# EAGLE board M868H (EAGLE 6.6.0), part 1 of 2
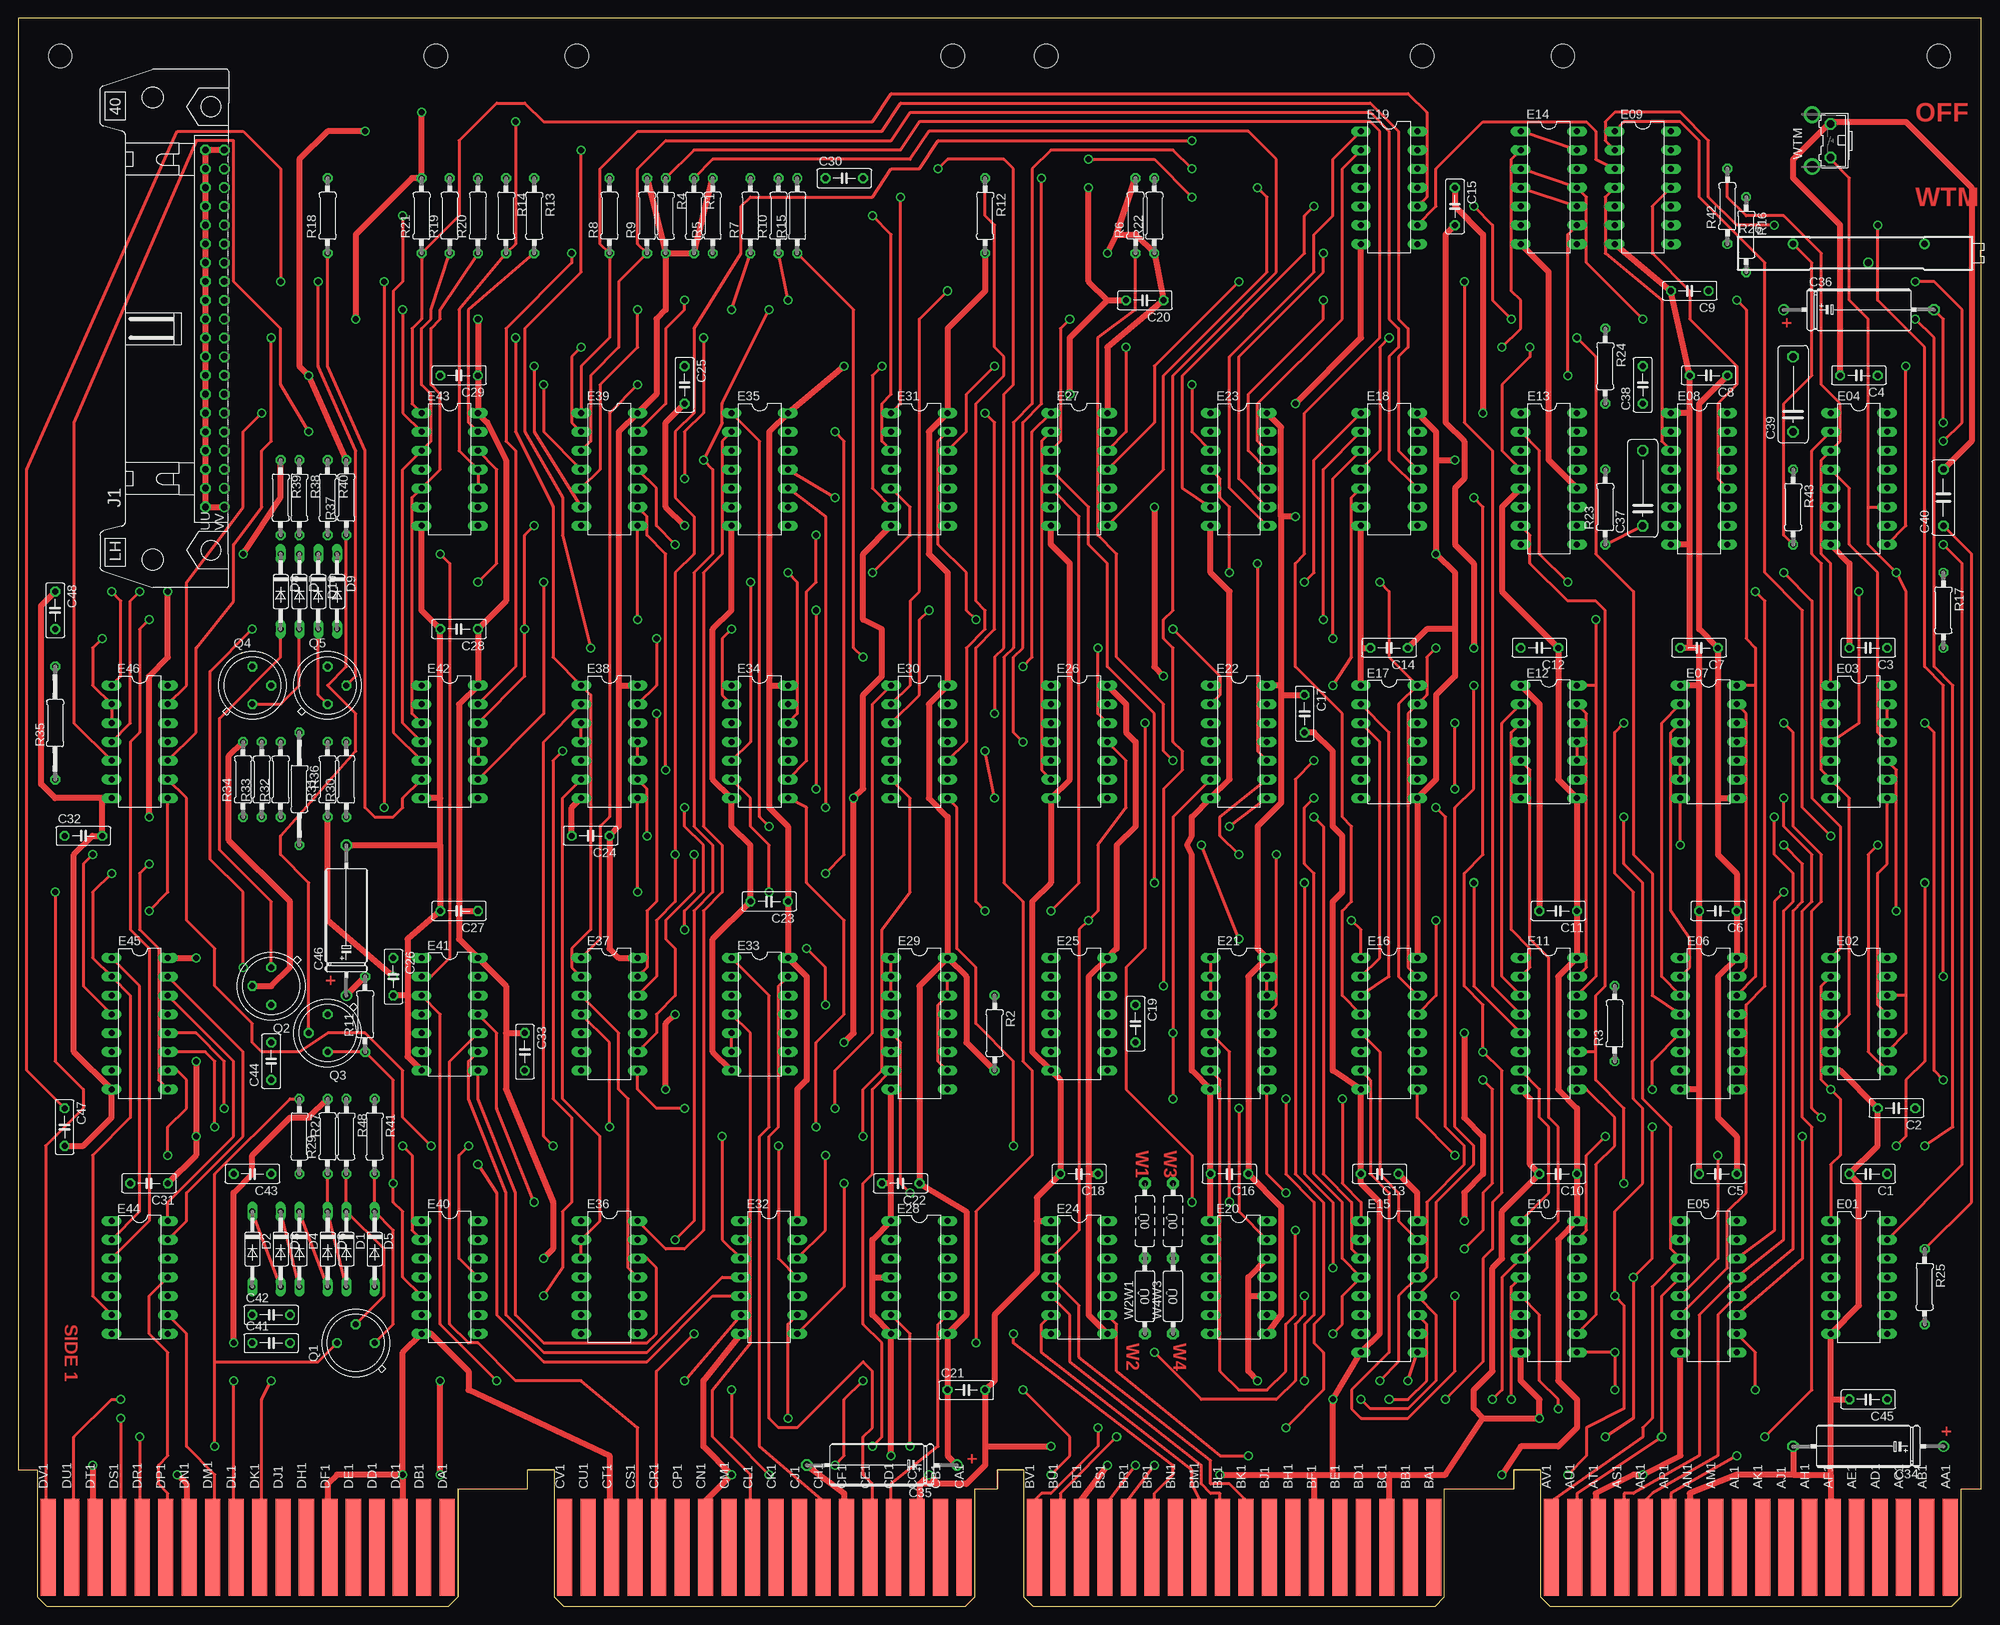
[diagram p3: board, top side]
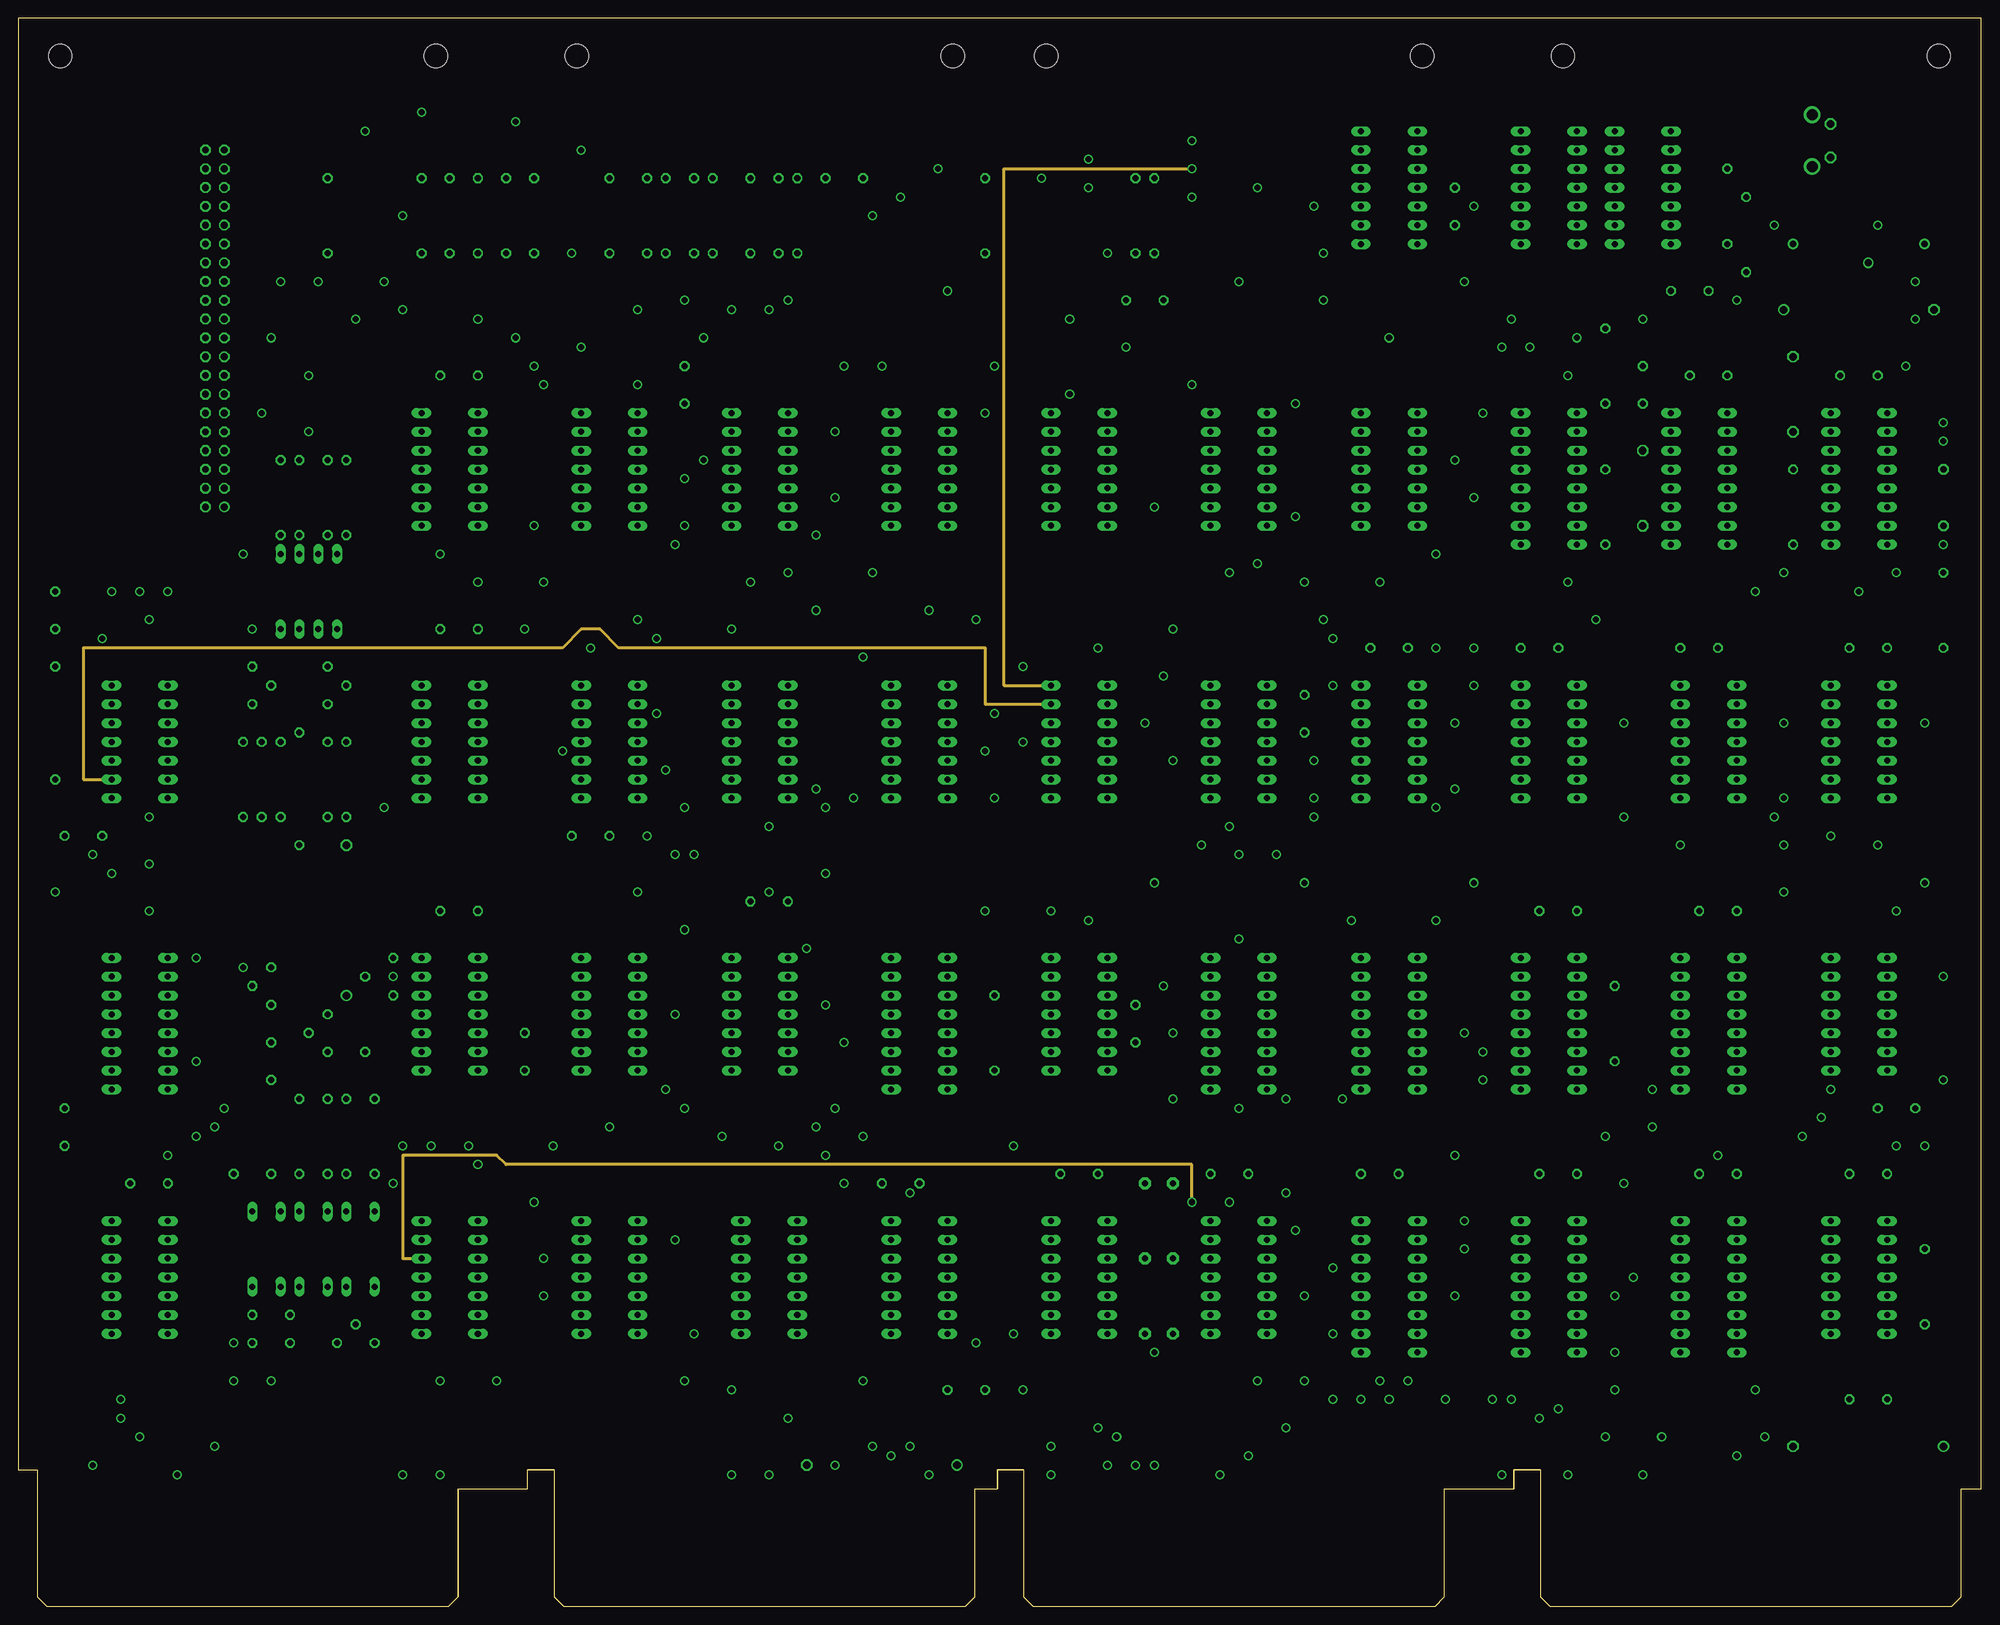
[diagram p4: board, inner layer ECO]
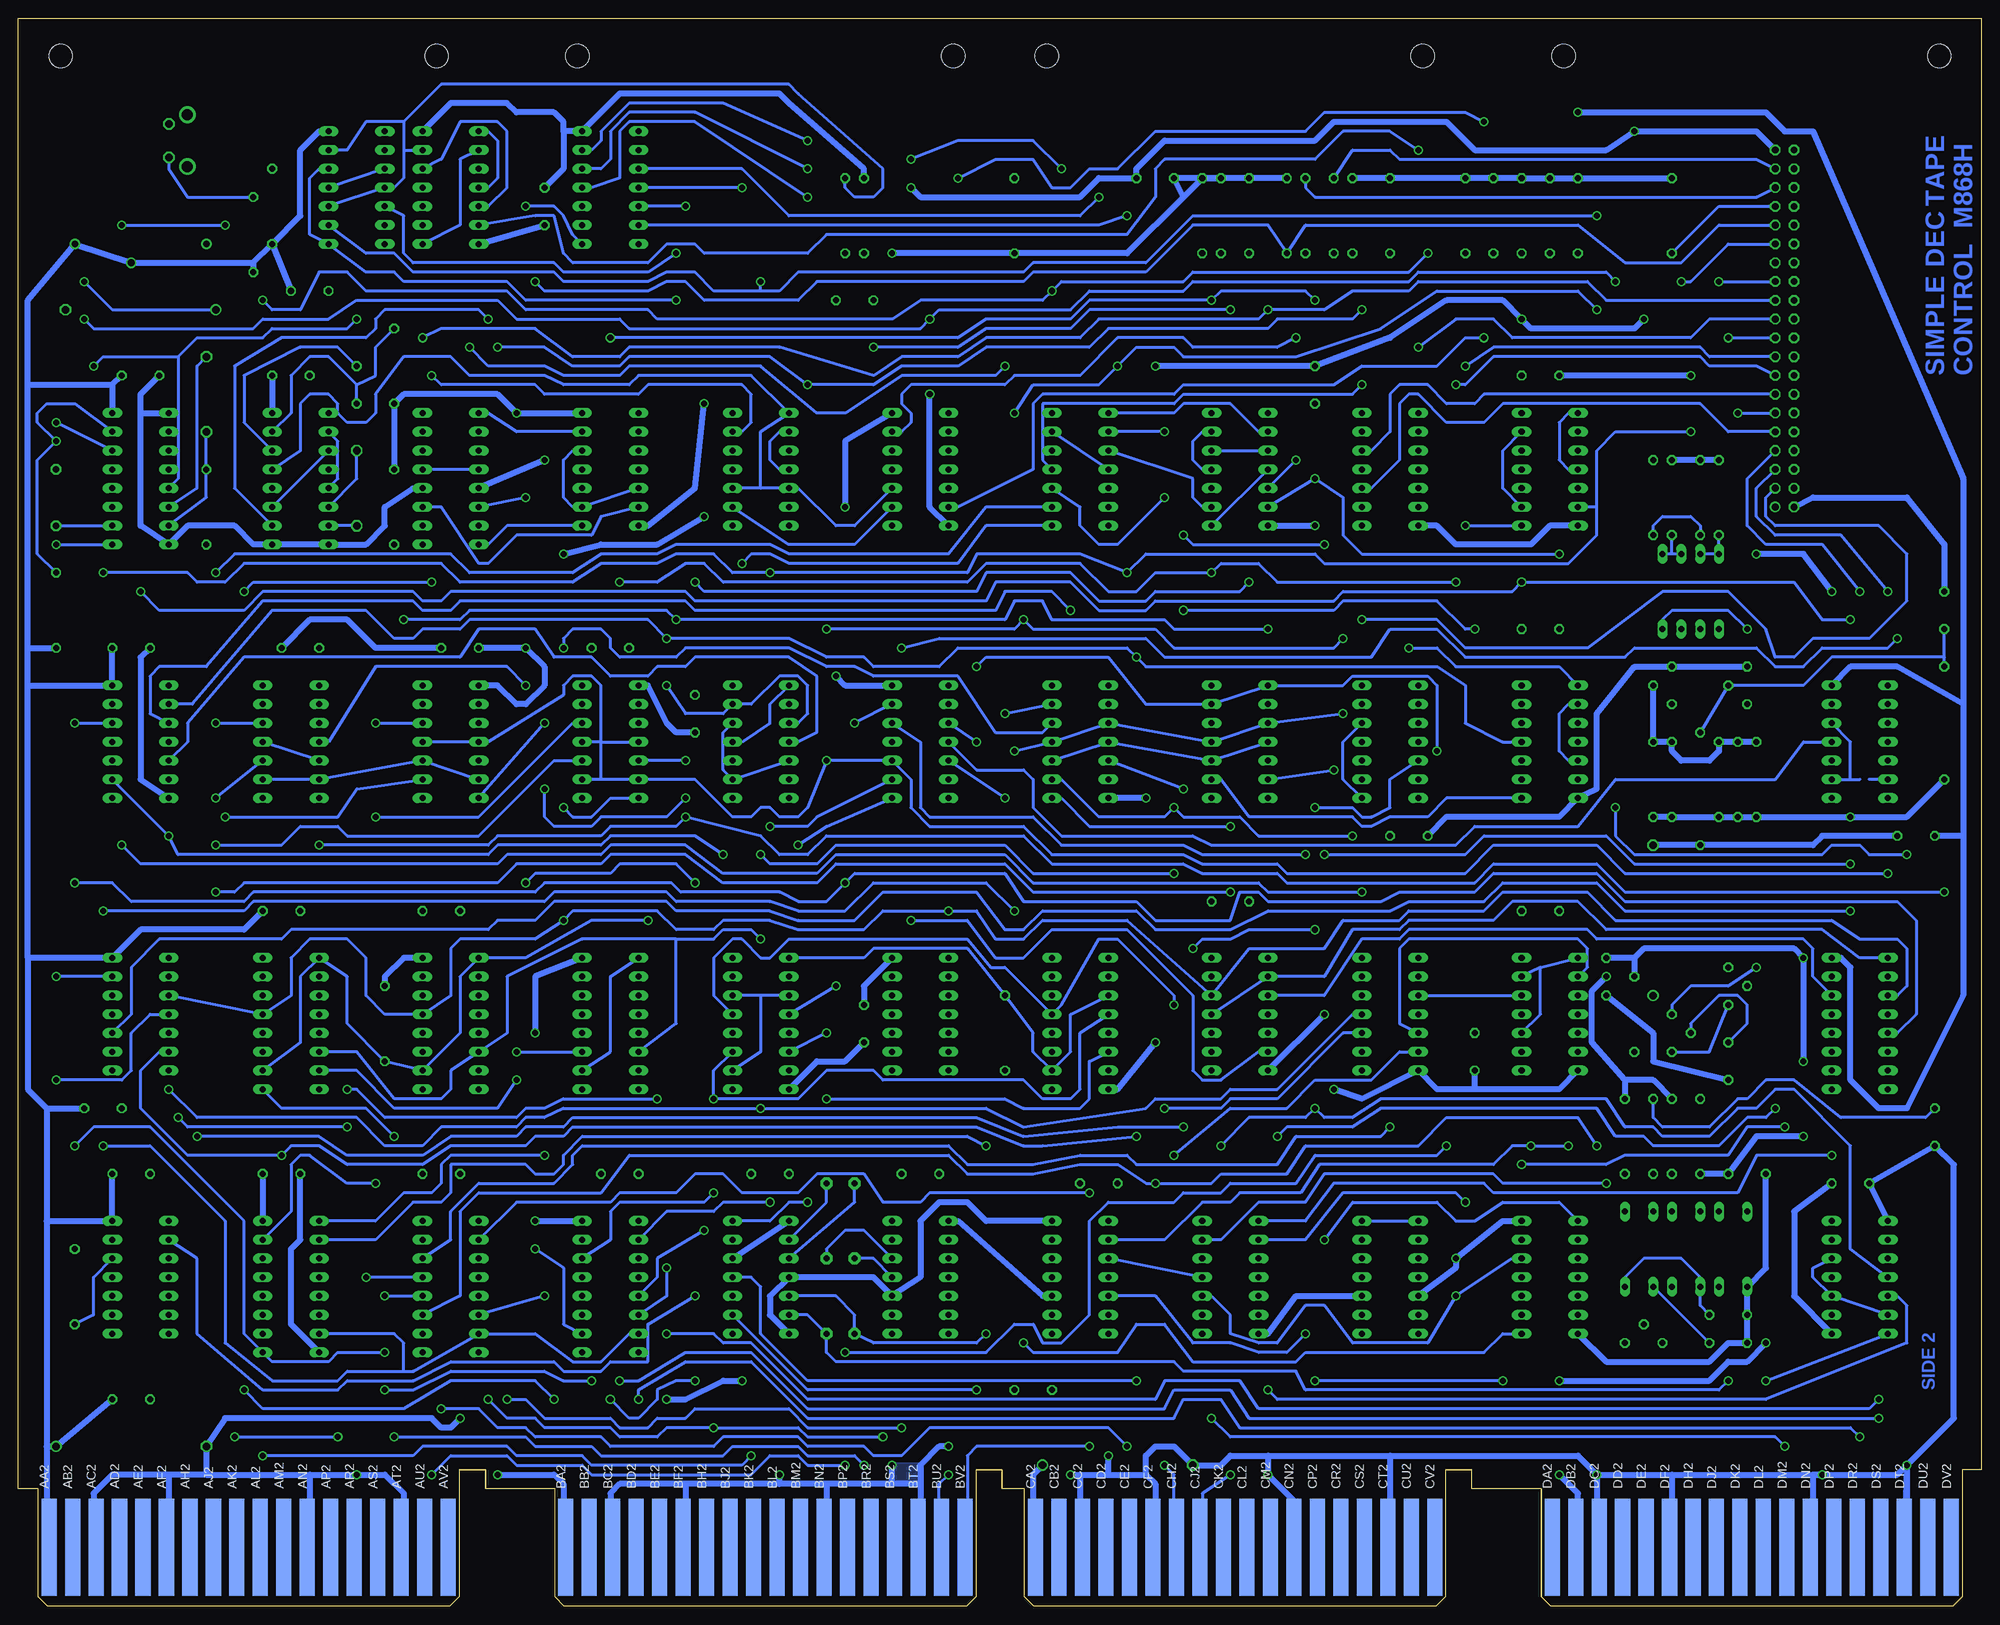
[diagram p5: board, bottom side, seen from below]

Size 265.3 x 214.63 mm. Coordinates in mm from the lower left corner, seen from the top.
Copper layers (1+2+3+16): Top 0.035mm / dielectric 1.5mm / ECO 0.035mm / dielectric 0.15mm / Route3 0.035mm / dielectric 0.2mm / Bottom 0.035mm
Design rules "16mils": minimum track width 16mil, minimum drill 32mil, track to track 15mil, track to pad 10mil, pad to pad 10mil, via to via 10mil, smd to smd 10mil, copper to edge 13mil, drill to drill 10mil, minimum pad ring 10mil, minimum via ring 8mil, stop-mask expansion 0mil, vias tented up to drill 0mil, thermal gap 10mil
Net classes: 1 supply: width 0.635 mm

## Footprints (pad centres in the part's own frame; a part is rotated, then mirrored left to right if it is on the bottom)
C050-025X075 = drill 0.813 octagon: 1 -2.54,0; 2 2.54,0
E12-8 = drill 1.016: + -10.16,0 | drill 1.016 octagon: - 10.16,0
C102-043X133 = drill 1.016 octagon: 1 -5.08,0; 2 5.08,0
C075-032X103 = drill 0.914 octagon: 1 -3.81,0; 2 3.81,0
DO35-10 = drill 0.813 long: A 5.08,0; C -5.08,0
DIL14 = drill 0.813 long: 1 -7.62,-3.81; 2 -5.08,-3.81; 3 -2.54,-3.81; 4 0,-3.81; 5 2.54,-3.81; 6 5.08,-3.81; 7 7.62,-3.81; 8 7.62,3.81; 9 5.08,3.81; 10 2.54,3.81; 11 0,3.81; 12 -2.54,3.81; 13 -5.08,3.81; 14 -7.62,3.81
DIL16 = drill 0.813 long: 1 -8.89,-3.81; 2 -6.35,-3.81; 3 -3.81,-3.81; 4 -1.27,-3.81; 5 1.27,-3.81; 6 3.81,-3.81; 7 6.35,-3.81; 8 8.89,-3.81; 9 8.89,3.81; 10 6.35,3.81; 11 3.81,3.81; 12 1.27,3.81; 13 -1.27,3.81; 14 -3.81,3.81; 15 -6.35,3.81; 16 -8.89,3.81
EDGE-CON8 = smd 2.032 x 13.106: AA1 261.303,7.938; AB1 258.127,7.938; AC1 254.952,7.938; AD1 251.778,7.938; AE1 248.602,7.938; AF1 245.428,7.938; AH1 242.252,7.938; AJ1 239.077,7.938; AK1 235.903,7.938; AL1 232.727,7.938; AM1 229.553,7.938; AN1 226.377,7.938; AP1 223.202,7.938; AR1 220.028,7.938; AS1 216.852,7.938; AT1 213.678,7.938; AU1 210.502,7.938; AV1 207.327,7.938; BA1 191.452,7.938; BB1 188.278,7.938; BC1 185.102,7.938; BD1 181.928,7.938; BE1 178.752,7.938; BF1 175.577,7.938; BH1 172.403,7.938; BJ1 169.227,7.938; BK1 166.053,7.938; BL1 162.877,7.938; BM1 159.702,7.938; BN1 156.528,7.938; BP1 153.352,7.938; BR1 150.178,7.938; BS1 147.002,7.938; BT1 143.827,7.938; BU1 140.653,7.938; BV1 137.477,7.938; CA1 127.953,7.938; CB1 124.778,7.938; CC1 121.603,7.938; CD1 118.427,7.938; CE1 115.252,7.938; CF1 112.078,7.938; CH1 108.903,7.938; CJ1 105.728,7.938; CK1 102.552,7.938; CL1 99.377,7.938; CM1 96.203,7.938; CN1 93.028,7.938; CP1 89.853,7.938; CR1 86.677,7.938; CS1 83.502,7.938; CT1 80.328,7.938; CU1 77.153,7.938; CV1 73.978,7.938; DA1 58.102,7.938; DB1 54.928,7.938; DC1 51.752,7.938; DD1 48.578,7.938; DE1 45.403,7.938; DF1 42.227,7.938; DH1 39.053,7.938; DJ1 35.877,7.938; DK1 32.703,7.938; DL1 29.527,7.938; DM1 26.352,7.938; DN1 23.177,7.938; DP1 20.003,7.938; DR1 16.828,7.938; DS1 13.652,7.938; DT1 10.477,7.938; DU1 7.303,7.938; DV1 4.128,7.938 | smd 2.032 x 13.106 bottom: AA2 261.303,7.938; AB2 258.127,7.938; AC2 254.952,7.938; AD2 251.778,7.938; AE2 248.602,7.938; AF2 245.428,7.938; AH2 242.252,7.938; AJ2 239.077,7.938; AK2 235.903,7.938; AL2 232.727,7.938; AM2 229.553,7.938; AN2 226.377,7.938; AP2 223.202,7.938; AR2 220.028,7.938; AS2 216.852,7.938; AT2 213.678,7.938; AU2 210.502,7.938; AV2 207.327,7.938; BA2 191.452,7.938; BB2 188.278,7.938; BC2 185.102,7.938; BD2 181.928,7.938; BE2 178.752,7.938; BF2 175.577,7.938; BH2 172.403,7.938; BJ2 169.227,7.938; BK2 166.053,7.938; BL2 162.877,7.938; BM2 159.702,7.938; BN2 156.528,7.938; BP2 153.352,7.938; BR2 150.178,7.938; BS2 147.002,7.938; BT2 143.827,7.938; BU2 140.653,7.938; BV2 137.477,7.938; CA2 127.953,7.938; CB2 124.778,7.938; CC2 121.603,7.938; CD2 118.427,7.938; CE2 115.252,7.938; CF2 112.078,7.938; CH2 108.903,7.938; CJ2 105.728,7.938; CK2 102.552,7.938; CL2 99.377,7.938; CM2 96.203,7.938; CN2 93.028,7.938; CP2 89.853,7.938; CR2 86.677,7.938; CS2 83.502,7.938; CT2 80.328,7.938; CU2 77.153,7.938; CV2 73.978,7.938; DA2 58.102,7.938; DB2 54.928,7.938; DC2 51.752,7.938; DD2 48.578,7.938; DE2 45.403,7.938; DF2 42.227,7.938; DH2 39.053,7.938; DJ2 35.877,7.938; DK2 32.703,7.938; DL2 29.527,7.938; DM2 26.352,7.938; DN2 23.177,7.938; DP2 20.003,7.938; DR2 16.828,7.938; DS2 13.652,7.938; DT2 10.477,7.938; DU2 7.303,7.938; DV2 4.128,7.938
DEC40PINH = drill 0.914 octagon: A 24.13,1.27; AA -3.81,1.27; B 24.13,-1.27; BB -3.81,-1.27; C 21.59,1.27; CC -6.35,1.27; D 21.59,-1.27; DD -6.35,-1.27; E 19.05,1.27; EE -8.89,1.27; F 19.05,-1.27; FF -8.89,-1.27; H 16.51,1.27; HH -11.43,1.27; J 16.51,-1.27; JJ -11.43,-1.27; K 13.97,1.27; KK -13.97,1.27; L 13.97,-1.27; LL -13.97,-1.27; M 11.43,1.27; MM -16.51,1.27; N 11.43,-1.27; NN -16.51,-1.27; P 8.89,1.27; PP -19.05,1.27; R 8.89,-1.27; RR -19.05,-1.27; S 6.35,1.27; SS -21.59,1.27; T 6.35,-1.27; TT -21.59,-1.27; U 3.81,1.27; UU -24.13,1.27; V 3.81,-1.27; W 1.27,1.27; X 1.27,-1.27; Y -1.27,1.27; Z -1.27,-1.27 | drill 0.914: VV -24.13,-1.27
TO5 = drill 0.813 octagon: 1 0,-2.54; 2 2.54,0; 3 0,2.54
0207/10 = drill 0.813 octagon: 1 -5.08,0; 2 5.08,0
3006Y = drill 0.9: 1 -8.89,1.27; 2 1.27,-1.27; 3 8.89,1.27
0207/15 = drill 0.813 octagon: 1 -7.62,0; 2 7.62,0
OMNIBUS = hole 3.175: 208.915,209.55; 259.715,209.55; 189.865,209.55; 139.065,209.55; 75.616,209.55; 126.416,209.55; 56.566,209.55; 5.766,209.55
0R2/10 = drill 0.813 pad 1.6 octagon: 1 -5.08,0; 2 5.08,0; 3 15.24,0
B3F-31XX = drill 1.016 octagon: 1 -2.261,-1.245; 2 2.261,-1.245 | drill 1.499 pad 2.159: 3 -3.505,1.245; 4 3.505,1.245

## Placement (x,y rotation side)
C1  .01  [C050-025X075]  250.06,58.42 180 top
C2  .01  [C050-025X075]  253.87,67.31 180 top
C3  .01  [C050-025X075]  250.06,129.54 180 top
C4  .01  [C050-025X075]  248.79,166.37 180 top
C5  .01  [C050-025X075]  229.74,58.42 180 top
C6  .01  [C050-025X075]  229.74,93.98 180 top
C7  .01  [C050-025X075]  227.2,129.54 180 top
C8  .01  [C050-025X075]  228.47,166.37 180 top
C9  .01  [C050-025X075]  225.93,177.8 180 top
C10  .01  [C050-025X075]  208.15,58.42 180 top
C11  .01  [C050-025X075]  208.15,93.98 180 top
C12  .01  [C050-025X075]  205.61,129.54 180 top
C13  .01  [C050-025X075]  184.02,58.42 180 top
C14  .01  [C050-025X075]  185.29,129.54 180 top
C15  .01  [C050-025X075]  194.18,189.23 270 top
C16  .01  [C050-025X075]  163.7,58.42 180 top
C17  .01  [C050-025X075]  173.86,120.65 270 top
C18  .01  [C050-025X075]  143.38,58.42 180 top
C19  .01  [C050-025X075]  151,78.74 270 top
C20  .01  [C050-025X075]  152.27,176.53 180 top
C21  .01  [C050-025X075]  128.14,29.21 0 top
C22  .01  [C050-025X075]  119.25,57.15 180 top
C23  .01  [C050-025X075]  101.47,95.25 180 top
C24  .01  [C050-025X075]  77.34,104.14 180 top
C25  .01  [C050-025X075]  90.04,165.1 270 top
C26  .01  [C050-025X075]  50.67,85.09 270 top
C27  .01  [C050-025X075]  59.56,93.98 180 top
C28  .01  [C050-025X075]  59.56,132.08 180 top
C29  .01  [C050-025X075]  59.56,166.37 180 top
C30  .01  [C050-025X075]  111.63,193.04 0 top
C31  .01  [C050-025X075]  17.65,57.15 180 top
C32  .01  [C050-025X075]  8.76,104.14 0 top
C33  .01  [C050-025X075]  68.45,74.93 270 top
C34  6.8uF  [E12-8]  250.06,21.59 180 top
C35  6.8uF  [E12-8]  116.71,19.05 180 top
C36  6.8uF  [E12-8]  248.79,175.26 0 top
C37  2700pf  [C102-043X133]  219.58,151.13 90 top
C38  27pf  [C050-025X075]  219.58,165.1 90 top
C39  2700pf  [C102-043X133]  239.9,163.83 90 top
C40  560pf  [C075-032X103]  260.22,149.86 90 top
C41  .01  [C050-025X075]  34.16,35.56 0 top
C42  .01  [C050-025X075]  34.16,39.37 0 top
C43  .01  [C050-025X075]  31.62,58.42 180 top
C44  .01  [C050-025X075]  34.16,73.66 90 top
C45  .01  [C050-025X075]  250.06,27.94 180 top
C46  6.8uF  [E12-8]  44.32,92.71 90 top
C47  .01  [C050-025X075]  6.22,64.77 270 top
C48  .01  [C050-025X075]  4.95,134.62 270 top
D1  D664  [DO35-10]  44.32,48.26 270 top
D2  D662  [DO35-10]  31.62,48.26 270 top
D3  D662  [DO35-10]  35.43,48.26 270 top
D4  D662  [DO35-10]  37.97,48.26 270 top
D5  D664  [DO35-10]  48.13,48.26 270 top
D6  D662  [DO35-10]  41.78,48.26 270 top
D7  D664  [DO35-10]  37.97,137.16 270 top
D8  D664  [DO35-10]  35.43,137.16 270 top
D9  D664  [DO35-10]  43.05,137.16 270 top
D10  D664  [DO35-10]  40.51,137.16 270 top
E01  74H04N  [DIL14]  248.79,44.45 270 top
E02  7402N  [DIL14]  248.79,80.01 270 top
E03  7474N  [DIL14]  248.79,116.84 270 top
E04  74123N  [DIL16]  248.79,152.4 270 top
E05  DEC8235  [DIL16]  228.47,43.18 270 top
E06  DEC8271  [DIL16]  228.47,78.74 270 top
E07  SP380N  [DIL14]  228.47,116.84 270 top
E08  74123N  [DIL16]  227.2,152.4 270 top
E09  7474N  [DIL14]  219.58,191.77 270 top
E10  DEC8235  [DIL16]  206.88,43.18 270 top
E11  DEC8271  [DIL16]  206.88,78.74 270 top
E12  SP380N  [DIL14]  206.88,116.84 270 top
E13  7475N  [DIL16]  206.88,152.4 270 top
E14  7474N  [DIL14]  206.88,191.77 270 top
E15  DEC8235  [DIL16]  185.29,43.18 270 top
E16  DEC8271  [DIL16]  185.29,78.74 270 top
E17  SP380N  [DIL14]  185.29,116.84 270 top
E18  DEC8242  [DIL14]  185.29,153.67 270 top
E19  7400N  [DIL14]  185.29,191.77 270 top
E20  SP380N  [DIL14]  164.97,44.45 270 top
E21  DEC8271  [DIL16]  164.97,78.74 270 top
E22  7400N  [DIL14]  164.97,116.84 270 top
E23  7410N  [DIL14]  164.97,153.67 270 top
E24  SP314N  [DIL14]  143.38,44.45 270 top
E25  SPARE  [DIL14]  143.38,80.01 270 top
E26  7404N  [DIL14]  143.38,116.84 270 top
E27  7410N  [DIL14]  143.38,153.67 270 top
E28  SP384N  [DIL14]  121.79,44.45 270 top
E29  DEC8271  [DIL16]  121.79,78.74 270 top
E30  7474N  [DIL14]  121.79,116.84 270 top
E31  7404N  [DIL14]  121.79,153.67 270 top
E32  7404N  [DIL14]  101.47,44.45 270 top
E33  N8881N  [DIL14]  100.2,80.01 270 top
E34  7474N  [DIL14]  100.2,116.84 270 top
E35  7410N  [DIL14]  100.2,153.67 270 top
E36  74LS93N  [DIL14]  79.88,44.45 270 top
E37  7402N  [DIL14]  79.88,80.01 270 top
E38  7400N  [DIL14]  79.88,116.84 270 top
E39  7417N  [DIL14]  79.88,153.67 270 top
E40  7430N  [DIL14]  58.29,44.45 270 top
E41  N8881N  [DIL14]  58.29,80.01 270 top
E42  DEC8242  [DIL14]  58.29,116.84 270 top
E43  7401N  [DIL14]  58.29,153.67 270 top
E44  SP380N  [DIL14]  16.38,44.45 270 top
E45  DEC8251  [DIL16]  16.38,78.74 270 top
E46  7401N  [DIL14]  16.38,116.84 270 top
EDGE$  [EDGE-CON8]  -0.13,0 0 top
J1  [DEC40PINH]  26.54,172.72 90 top
Q1  MPS6534  [TO5]  45.59,35.56 90 top
Q2  MPS6534  [TO5]  34.16,83.82 180 top
Q3  MPS6534  [TO5]  41.78,77.47 180 top
Q4  MPS6534  [TO5]  31.62,124.46 0 top
Q5  MPS6534  [TO5]  41.78,124.46 0 top
R1  270  [0207/10]  91.31,187.96 270 top
R2  1K  [0207/10]  131.95,77.47 270 top
R3  1K  [0207/10]  215.77,78.74 90 top
R4  270  [0207/10]  87.5,187.96 270 top
R5  270  [0207/10]  93.85,187.96 90 top
R6  560  [0207/10]  151,187.96 90 top
R7  270  [0207/10]  98.93,187.96 90 top
R8  470  [0207/10]  79.88,187.96 90 top
R9  470  [0207/10]  84.96,187.96 90 top
R10  470  [0207/10]  102.74,187.96 90 top
R11  6.8K  [0207/10]  46.86,80.01 90 top
R12  1K  [0207/10]  130.68,187.96 270 top
R13  470  [0207/10]  69.72,187.96 270 top
R14  470  [0207/10]  65.91,187.96 270 top
R15  470  [0207/10]  105.28,187.96 90 top
R16  1.5K  [0207/10]  233.55,185.42 270 top
R17  51K  [0207/10]  260.22,134.62 270 top
R18  270  [0207/10]  41.78,187.96 90 top
R19  470  [0207/10]  58.29,187.96 90 top
R20  470  [0207/10]  62.1,187.96 90 top
R21  470  [0207/10]  54.48,187.96 90 top
R22  1K  [0207/10]  153.54,187.96 90 top
R23  10K  [0207/10]  214.5,148.59 90 top
R24  4.7K  [0207/10]  214.5,167.64 270 top
R25  220  [0207/10]  257.68,43.18 270 top
R26  20K  [3006Y]  248.79,182.88 0 top
R27  1.5K  [0207/10]  37.97,63.5 270 top
R29  1.5K  [0207/10]  41.78,63.5 90 top
R30  1K  [0207/10]  44.32,111.76 90 top
R31  1K  [0207/10]  41.78,111.76 90 top
R32  1K  [0207/10]  35.43,111.76 90 top
R33  1K  [0207/10]  32.89,111.76 90 top
R34  1K  [0207/10]  30.35,111.76 90 top
R35  1.21K 1%  [0207/15]  4.95,119.38 90 top
R36  562 1%  [0207/15]  37.97,110.49 270 top
R37  1.5K  [0207/10]  44.32,149.86 90 top
R38  1K  [0207/10]  37.97,149.86 270 top
R39  1.5K  [0207/10]  35.43,149.86 270 top
R40  1K  [0207/10]  41.78,149.86 270 top
R41  3K  [0207/10]  48.13,63.5 270 top
R42  1K  [0207/10]  231.01,189.23 90 top
R43  4.7K  [0207/10]  239.9,148.59 270 top
R48  470  [0207/10]  44.32,63.5 270 top
U$1  OUTLINE-OMNIBUS  [OMNIBUS]  -0.13,0 0 top
W2W1  [0R2/10]  152.27,41.91 90 top
W4W3  [0R2/10]  156.08,41.91 90 top
WTM  [B3F-31XX]  243.71,198.12 90 top

## Tracks (layer width: path | path; a pad name or v marks a point on that pad's centre or on a via)
!CC_67X  (via drill 0.81)
  Top 0.406: E07.6 E07.5 | E12.11 E12.10 | v12.57,99.06 10.03,96.52 10.03,87.63 E45.2 15.11,82.55 15.11,66.04 10.03,60.96 10.03,41.91 E44.6 | v156.08,114.3 154.81,115.57 154.81,121.92 148.46,128.27 148.46,142.24 145.92,144.78 145.92,171.45 151,175.26 R6.1
  Bottom 0.406: 186.56,116.84 E17.4 | 186.56,116.84 E17.11 | 186.56,111.76 E17.9 | 186.56,111.76 186.56,116.84 | 186.56,111.76 E17.6 173.86,111.76 168.78,106.68 166.24,106.68 164.97,107.95 163.7,107.95 162.43,106.68 159.89,106.68 158.62,107.95 v156.08,114.3 E26.10 144.65,111.76 144.65,107.95 142.11,105.41 129.41,105.41 125.6,101.6 107.82,101.6 105.28,100.33 95.12,100.33 93.85,99.06 69.72,99.06 65.91,102.87 51.94,102.87 48.13,99.06 v12.57,99.06 | 186.56,116.84 186.56,124.46 187.83,125.73 190.37,125.73 191.64,124.46 191.64,123.19 201.8,116.84 E12.4 E12.11 | E07.9 E07.6 E12.10 E12.6 | E07.5 E07.11 | E44.12 22.73,45.72 22.73,44.45 E44.10 E44.6
!CC_CLK_TE
  Top 0.406: E27.2 138.3,157.48 138.3,113.03 E26.6
!CC_DTP0  (via drill 0.81)
  Top 0.406: E22.2 162.43,123.19 162.43,125.73 v156.08,132.08 | E38.13 86.23,124.46 v86.23,130.81 | E31.13 124.33,157.48 124.33,143.51 128.14,139.7 128.14,134.62 v129.41,133.35
  Bottom 0.406: E31.13 E31.4 | v156.08,132.08 130.68,132.08 v129.41,133.35 128.14,132.08 111.63,132.08 109.09,129.54 87.5,129.54 v86.23,130.81
!CC_DTP1  (via drill 0.81)
  Top 0.406: v110.36,158.75 111.63,157.48 111.63,101.6 v109.09,99.06 | v164.97,101.6 162.43,104.14 162.43,106.68 E22.9
  Bottom 0.406: E22.5 E22.9 170.05,113.03 170.05,118.11 E22.12 | v110.36,158.75 E31.2 | v109.09,99.06 128.14,99.06 131.95,102.87 154.81,102.87 157.35,100.33 163.7,100.33 v164.97,101.6
!CC_INIT  (via drill 0.81)
  Top 0.406: v73.53,115.57 72.26,114.3 72.26,68.58 74.8,66.04 74.8,54.61 73.53,53.34 73.53,45.72 v70.99,41.91 | E27.1 137.03,158.75 137.03,128.27 v135.76,127
  Bottom 0.406: v135.76,127 134.49,128.27 117.98,128.27 112.9,121.92 E34.13 E34.1 86.23,124.46 84.96,125.73 74.8,125.73 73.53,124.46 v73.53,115.57 | E40.12 63.37,46.99 v70.99,41.91 74.8,35.56 84.96,35.56 88.77,40.64 91.31,40.64 95.12,35.56 97.66,35.56 101.47,36.83 101.47,39.37 104.01,41.91 E32.10
!CC_RUN  (via drill 0.81)
  Top 0.406: v158.62,54.61 158.62,60.96 149.73,69.85 149.73,86.36 152.27,88.9 v152.27,119.38
  ECO 0.406: E40.3 51.94,46.99 51.94,60.96 64.64,60.96 65.91,59.69 158.62,59.69 v158.62,54.61
  Bottom 0.406: E26.13 v152.27,119.38 | E20.14 163.7,52.07 161.16,54.61 v158.62,54.61
!CC_SDLC  (via drill 0.81)
  Top 0.406: E37.12 86.23,85.09 86.23,92.71 88.77,95.25 v88.77,101.6 88.77,139.7 91.31,142.24 91.31,147.32 88.77,149.86 88.77,158.75 91.31,161.29 91.31,172.72 97.66,182.88 97.66,189.23 98.93,190.5 115.44,190.5 117.98,194.31 121.79,194.31 124.33,198.12 v158.62,198.12 | E45.9 18.92,71.12 18.92,88.9 16.38,91.44 16.38,99.06 v17.65,100.33
  Bottom 0.406: E19.13 187.83,196.85 186.56,198.12 186.56,199.39 182.75,203.2 170.05,203.2 v158.62,198.12 | v88.77,101.6 69.72,101.6 67.18,104.14 50.67,104.14 46.86,100.33 v17.65,100.33
!CC_SDLD  (via drill 0.81)
  Top 0.406: v139.57,93.98 143.38,97.79 143.38,147.32 E27.5 | E16.13 191.64,82.55 v191.64,92.71
  Bottom 0.406: E02.3 E06.13 228.47,82.55 228.47,87.63 225.93,90.17 220.85,90.17 218.31,87.63 218.31,82.55 215.77,80.01 E11.13 206.88,82.55 206.88,88.9 205.61,90.17 195.45,90.17 v191.64,92.71 190.37,93.98 178.94,93.98 176.4,91.44 171.32,91.44 170.05,92.71 163.7,92.71 159.89,91.44 151,91.44 148.46,93.98 v139.57,93.98 135.76,93.98 133.22,90.17 129.41,90.17 126.87,92.71 115.44,92.71 E33.12 98.93,88.9 88.77,88.9 86.23,92.71 78.61,92.71 77.34,93.98 67.18,93.98 64.64,96.52 53.21,96.52 49.4,92.71 20.19,92.71 16.38,90.17 11.3,90.17 10.03,88.9 10.03,83.82 11.3,82.55 E45.3
!CC_SDRC  (via drill 0.81)
  Top 0.406: E45.4 8.76,83.82 8.76,100.33 v10.03,101.6 | v257.68,62.23 261.49,64.77 261.49,124.46 258.95,127 258.95,171.45 v256.41,173.99 | E27.3 140.84,157.48 140.84,172.72 v142.11,173.99 | v49.4,179.07 v49.4,107.95 | E10.9 v215.77,34.29 v215.77,29.21 | v187.83,30.48 E15.9
  Bottom 0.406: v10.03,101.6 15.11,101.6 16.38,102.87 20.19,102.87 21.46,101.6 46.86,101.6 49.4,104.14 v49.4,107.95 | v257.68,62.23 255.14,64.77 247.52,64.77 234.82,52.07 234.82,36.83 E05.9 231.01,33.02 223.39,33.02 222.12,34.29 v215.77,34.29 | v256.41,173.99 255.14,172.72 233.55,172.72 232.28,173.99 223.39,173.99 219.58,176.53 200.53,176.53 197.99,173.99 184.02,173.99 182.75,172.72 143.38,172.72 v142.11,173.99 140.84,175.26 123.06,175.26 120.52,177.8 107.82,177.8 106.55,179.07 77.34,179.07 76.07,180.34 50.67,180.34 v49.4,179.07 | v215.77,29.21 211.96,29.21 206.88,31.75 194.18,31.75 191.64,30.48 v187.83,30.48
!CC_SDRD  (via drill 0.81)
  Top 0.406: E27.4 144.65,148.59 144.65,143.51 147.19,140.97 147.19,127 153.54,120.65 v153.54,97.79 | v253.87,62.23 255.14,63.5 255.14,71.12 257.68,73.66 v257.68,97.79
  Bottom 0.406: E45.5 11.3,77.47 8.76,80.01 8.76,92.71 11.3,95.25 48.13,95.25 51.94,99.06 65.91,99.06 68.45,96.52 78.61,96.52 81.15,95.25 96.39,95.25 97.66,96.52 100.2,96.52 101.47,92.71 111.63,92.71 114.17,95.25 129.41,95.25 131.95,99.06 152.27,99.06 v153.54,97.79 156.08,95.25 159.89,95.25 162.43,96.52 175.77,96.52 177.04,97.79 194.18,97.79 195.45,96.52 233.55,96.52 234.82,95.25 250.06,95.25 252.6,97.79 v257.68,97.79 | E15.7 182.75,36.83 186.56,33.02 190.37,33.02 195.45,36.83 E10.7 211.96,31.75 213.23,31.75 | 213.23,31.75 213.23,35.56 214.5,36.83 E05.7 | 213.23,31.75 220.85,31.75 222.12,30.48 231.01,30.48 237.36,35.56 237.36,52.07 247.52,62.23 v253.87,62.23
!CC_SDSQ  (via drill 0.81)
  Top 0.406: v20.19,60.96 20.19,64.77 22.73,67.31 22.73,71.12 21.46,72.39 E45.10
  Bottom 0.406: E32.1 91.31,52.07 87.5,57.15 67.18,57.15 65.91,55.88 32.89,55.88 30.35,60.96 v20.19,60.96
!CC_SDSS  (via drill 0.81)
  Top 0.406: E45.12 24,77.47 27.81,73.66 v27.81,67.31 | E32.3 95.12,49.53 v95.12,63.5
  Bottom 0.406: v27.81,67.31 29.08,66.04 31.62,66.04 35.43,62.23 44.32,62.23 45.59,63.5 49.4,63.5 51.94,67.31 81.15,67.31 84.96,64.77 93.85,64.77 v95.12,63.5
!CC_SDST  (via drill 0.81)
  Top 0.406: E45.11 25.27,74.93 26.54,73.66 v26.54,64.77 | E32.5 93.85,41.91 84.96,33.02 70.99,33.02 64.64,39.37 64.64,55.88 v62.1,59.69
  Bottom 0.406: v26.54,64.77 31.62,64.77 34.16,60.96 48.13,60.96 50.67,59.69 v62.1,59.69
!CC_SETDLY
  Bottom 0.406: E22.4 159.89,116.84 157.35,118.11 157.35,125.73 161.16,128.27 173.86,128.27 175.13,127 178.94,127 180.21,125.73 185.29,125.73 187.83,128.27 192.91,128.27 195.45,132.08 203.07,132.08 205.61,128.27 234.82,128.27 242.44,119.38 242.44,116.84 E03.5
!CC_TP3  (via drill 0.81)
  Top 0.406: E20.13 164.97,53.34 v164.97,67.31 | E02.2 243.71,83.82 243.71,71.12 v244.98,69.85 246.25,68.58 246.25,60.96 244.98,59.69 E01.1
  Bottom 0.406: E37.11 84.96,80.01 95.12,69.85 101.47,69.85 102.74,68.58 111.63,68.58 112.9,67.31 129.41,64.77 134.49,67.31 v164.97,67.31 191.64,67.31 194.18,66.04 196.72,66.04 197.99,64.77 208.15,64.77 210.69,62.23 215.77,62.23 219.58,66.04 241.17,66.04 v244.98,69.85
!CC_TPG1  (via drill 0.81)
  Top 0.406: v76.07,196.85 76.07,180.34 68.45,172.72 68.45,158.75 73.53,149.86 73.53,144.78 v77.34,129.54
  Bottom 0.406: E42.1 57.02,127 70.99,127 73.53,129.54 v77.34,129.54 | E14.6 195.45,187.96 192.91,187.96 191.64,182.88 190.37,181.61 180.21,181.61 177.67,184.15 173.86,184.15 172.59,182.88 158.62,182.88 156.08,185.42 115.44,185.42 111.63,190.5 111.63,194.31 110.36,195.58 90.04,195.58 86.23,199.39 79.88,199.39 v76.07,196.85
!CC_TPG_CLK
  Top 0.406: R25.1 264.03,54.61 264.03,142.24 C40.1
  Bottom 0.406: C40.1 E04.10
!CC_UNIT  (via drill 0.81)
  Top 0.406: E34.8 106.55,107.95 106.55,97.79 111.63,92.71 111.63,80.01 107.82,76.2 v107.82,64.77 | E05.11 241.17,46.99 v241.17,63.5
  Bottom 0.406: v107.82,64.77 116.71,64.77 129.41,63.5 135.76,66.04 190.37,66.04 191.64,64.77 196.72,64.77 197.99,63.5 206.88,63.5 210.69,60.96 220.85,60.96 224.66,63.5 v241.17,63.5
!CC_UTS
  Top 0.406: E03.8 252.6,100.33 251.33,99.06 251.33,81.28 E02.11
!DF_HLD  (via drill 0.81)
  Top 0.406: E40.2 53.21,50.8 53.21,60.96 v51.94,62.23 | E32.8 111.63,43.18 v111.63,57.15
  Bottom 0.406: v51.94,62.23 54.48,66.04 72.26,66.04 76.07,62.23 91.31,62.23 93.85,58.42 102.74,58.42 104.01,57.15 v111.63,57.15 112.9,57.15 116.71,59.69 121.79,59.69 128.14,58.42 137.03,58.42 139.57,60.96 182.75,60.96 186.56,55.88 203.07,55.88 205.61,53.34 205.61,41.91 E10.11
!DF_SEL_ER  (via drill 0.81)
  Top 0.406: E40.5 51.94,44.45 51.94,53.34 50.67,54.61 v50.67,57.15 50.67,71.12 R11.1 Q3.3
  Bottom 0.406: Q3.3 36.7,74.93 Q2.3 | E32.13 102.74,49.53 97.66,54.61 91.31,54.61 88.77,58.42 65.91,58.42 64.64,57.15 v50.67,57.15
!DF_TIME_ER  (via drill 0.81)
  Top 0.406: E27.12 149.73,158.75 v149.73,170.18 | v101.47,175.26 95.12,162.56 95.12,160.02 v92.58,154.94 93.85,153.67 93.85,142.24 91.31,139.7 91.31,105.41 93.85,102.87 93.85,96.52 91.31,93.98 91.31,52.07 v88.77,49.53
  Bottom 0.406: v92.58,154.94 E35.5 | E40.1 57.02,54.61 64.64,54.61 68.45,52.07 70.99,52.07 73.53,54.61 84.96,54.61 v88.77,49.53 | v149.73,170.18 138.3,170.18 134.49,172.72 123.06,172.72 120.52,175.26 v101.47,175.26
!IO_PAUSE
  Bottom 0.813: E28.14 134.49,52.07 137.03,54.61 140.84,54.61 143.38,52.07 143.38,44.45 E24.10 149.73,44.45 E20.4 163.7,41.91 163.7,39.37 E20.7
!MTR0  (via drill 0.81)
  Top 0.406: E29.7 115.44,69.85 115.44,58.42 114.17,57.15 114.17,38.1 116.71,35.56 116.71,22.86 v115.44,21.59 | E10.5 205.61,39.37 205.61,30.48 208.15,27.94 v208.15,26.67
  Bottom 0.406: v115.44,21.59 117.98,24.13 142.11,24.13 145.92,20.32 149.73,20.32 151,21.59 158.62,21.59 159.89,22.86 170.05,22.86 171.32,21.59 185.29,21.59 186.56,22.86 195.45,22.86 196.72,24.13 200.53,24.13 203.07,26.67 v208.15,26.67
!MTR1  (via drill 0.81)
  Top 0.406: E29.5 119.25,76.2 119.25,57.15 v120.52,55.88
  Bottom 0.406: E10.2 197.99,54.61 185.29,54.61 184.02,55.88 176.4,55.88 173.86,58.42 170.05,58.42 167.51,55.88 159.89,55.88 157.35,58.42 151,58.42 148.46,54.61 143.38,54.61 142.11,55.88 v120.52,55.88
!MTR2  (via drill 0.81)
  Top 0.406: E15.11 190.37,38.1 190.37,30.48 187.83,27.94 v185.29,27.94 | v171.32,68.58 171.32,58.42 175.13,54.61 175.13,39.37 173.86,38.1 v173.86,30.48
  Bottom 0.406: E29.4 121.79,77.47 121.79,69.85 123.06,68.58 126.87,68.58 129.41,71.12 148.46,71.12 149.73,72.39 156.08,72.39 159.89,68.58 v171.32,68.58 171.32,72.39 E21.11 | v173.86,30.48 176.4,30.48 178.94,29.21 178.94,27.94 181.48,25.4 182.75,25.4 v185.29,27.94
!MTR3  (via drill 0.81)
  Top 0.406: v171.32,55.88 168.78,58.42 E21.9
  Bottom 0.406: E15.14 185.29,49.53 185.29,53.34 184.02,54.61 172.59,54.61 v171.32,55.88
!MTR4  (via drill 0.81)
  Top 0.406: v172.59,50.8 172.59,39.37 171.32,38.1 171.32,31.75 168.78,29.21 164.97,29.21 162.43,31.75 162.43,71.12 E21.7
  Bottom 0.406: E15.5 178.94,44.45 178.94,46.99 v172.59,50.8
!MTR5  (via drill 0.81)
  Top 0.406: E21.5 163.7,74.93 v163.7,54.61
  Bottom 0.406: E15.2 177.67,53.34 171.32,53.34 170.05,54.61 v163.7,54.61
!POWER_OK  (via drill 0.81)
  Top 0.406: v120.52,21.59 120.52,36.83 E28.6
  Bottom 0.406: EDGE$.BV2 137.03,8.89 137.03,20.32 135.76,21.59 v120.52,21.59
!RTT
  Top 0.406: E42.6 51.94,109.22 51.94,107.95 50.67,106.68 48.13,106.68 46.86,107.95 46.86,156.21 41.78,167.64 R18.1
  Bottom 0.406: J1.J 35.43,189.23 R18.1
!SKIP
  Top 0.406: E41.10 58.29,73.66 58.29,38.1 60.83,35.56 62.1,35.56 67.18,30.48 76.07,30.48 83.69,24.13 83.69,8.89 EDGE$.CS1
  Bottom 0.406: 59.56,86.36 E41.1 | 59.56,86.36 E41.13 | E41.10 59.56,80.01 59.56,86.36
-1.5V
  Top 0.406: D4.A D3.C
  Bottom 0.406: C42.2 37.97,40.64 D4.A 37.97,44.45 40.51,46.99 45.59,46.99 48.13,44.45 D5.A
-3V
  Top 0.406: D1.A D6.C R29.1
  Bottom 0.406: C41.2 D1.A
-4.7V
  Bottom 0.406: R35.2 4.95,128.27 | 4.95,128.27 C48.2 | R36.1 Q4.2 24,124.46 20.19,128.27 4.95,128.27
-9V
  Top 0.406: R37.1 44.32,127 41.78,124.46 45.59,120.65 45.59,115.57 35.43,104.14 35.43,101.6 39.24,97.79 Q3.2
  Bottom 0.406: R38.2 37.97,146.05 39.24,147.32 43.05,147.32 44.32,146.05 R37.1 | C44.2 31.62,78.74 31.62,81.28 32.89,82.55 35.43,82.55 39.24,78.74 Q3.2
-15V  (via drill 0.81)
  Top 0.813: v17.65,106.68 17.65,125.73 20.19,128.27 v20.19,137.16 | v30.35,142.24 35.43,149.86 R39.1 | v50.67,85.09 41.78,92.71 R31.1 | v57.02,17.78 v57.02,30.48 | v29.08,35.56 29.08,55.88 31.62,58.42 31.62,60.96 36.7,66.04 39.24,66.04 R29.2
  Bottom 0.813: R39.1 R38.1 R40.1 | R35.1 10.03,106.68 v17.65,106.68 R34.1 R33.1 R32.1 R31.1 R30.1 | v20.19,137.16 24,142.24 v30.35,142.24 | R29.2 44.32,71.12 48.13,71.12 | 48.13,71.12 R41.1 | 48.13,71.12 52.58,76.2 52.58,83.19 v50.67,85.09 | EDGE$.DB2 54.48,8.89 54.48,15.24 v57.02,17.78 | v57.02,30.48 36.7,30.48 34.16,33.02 31.62,33.02 v29.08,35.56
C0
  Top 0.406: EDGE$.CE1 115.44,8.89 115.44,16.51 114.17,17.78 114.17,22.86 115.44,24.13 115.44,31.75 114.17,33.02 105.28,24.13 102.74,24.13 101.47,25.4 101.47,63.5 102.74,64.77 102.74,83.82 E33.13
C1
  Top 0.406: EDGE$.CH1 109.09,8.89 109.09,13.97 100.2,21.59 100.2,63.5 101.47,64.77 101.47,82.55 E33.1
CC_67X  (via drill 0.81)
  Top 0.406: E24.3 143.38,50.8 143.38,91.44 v144.65,92.71 145.92,93.98 145.92,102.87 149.73,107.95 149.73,114.3 E26.11 | E33.6 E33.5
  Bottom 0.406: v144.65,92.71 137.03,92.71 133.22,87.63 129.41,87.63 125.6,91.44 115.44,91.44 106.55,82.55 106.55,72.39 105.28,71.12 102.74,71.12 97.66,74.93 E33.6
CC_BTP3  (via drill 0.81)
  Top 0.406: E38.2 70.99,116.84 70.99,63.5 v72.26,62.23 | v153.54,34.29 159.89,27.94 170.05,27.94 172.59,30.48 172.59,38.1 173.86,39.37 v173.86,41.91
  Bottom 0.406: E01.2 241.17,46.99 241.17,36.83 232.28,29.21 222.12,29.21 220.85,30.48 211.96,30.48 206.88,33.02 192.91,33.02 191.64,31.75 186.56,31.75 185.29,33.02 180.21,33.02 180.21,38.1 v173.86,41.91 | v72.26,62.23 73.53,60.96 90.04,60.96 92.58,57.15 101.47,57.15 102.74,55.88 107.82,55.88 109.09,54.61 117.98,54.61 120.52,52.07 120.52,39.37 124.33,35.56 126.87,35.56 128.14,38.1 130.68,38.1 134.49,34.29 v153.54,34.29
CC_DTP
  Bottom 0.406: E27.10 152.27,146.05 154.81,146.05 159.89,151.13 E23.5 164.97,151.13 | E08.13 227.2,156.21 227.2,162.56 225.93,163.83 223.39,163.83 222.12,162.56 222.12,161.29 220.85,160.02 218.31,160.02 217.04,161.29 217.04,163.83 213.23,168.91 206.88,168.91 204.34,166.37 194.18,166.37 191.64,165.1 182.75,165.1 181.48,166.37 166.24,166.37 E23.1 164.97,158.75 164.97,151.13 | 164.97,151.13 E23.10
CC_DTP0  (via drill 0.81)
  Top 0.406: E31.3 116.71,157.48 116.71,162.56 117.98,163.83 117.98,185.42 v115.44,187.96
  Bottom 0.406: E31.3 106.55,152.4 106.55,149.86 105.28,148.59 E35.9 | E19.6 119.25,186.69 v115.44,187.96
CC_DTP1  (via drill 0.81)
  Top 0.406: E31.1 119.25,162.56 v119.25,190.5 | E36.14 87.5,48.26 90.04,48.26 92.58,50.8 92.58,93.98 95.12,96.52 95.12,102.87 92.58,105.41 92.58,139.7 95.12,142.24 95.12,157.48 E35.2
  Bottom 0.406: E31.1 109.09,161.29 107.82,162.56 101.47,162.56 97.66,158.75 E35.2 | E19.3 167.51,194.31 161.16,187.96 121.79,187.96 v119.25,190.5 | E36.14 E36.1
CC_F/!R  (via drill 0.81)
  Top 0.406: E39.9 84.96,147.32 84.96,144.78 87.5,142.24 v87.5,113.03 | E05.14 237.36,50.8 237.36,95.25 v238.63,96.52 | E34.6 98.93,109.22 98.93,105.41 101.47,102.87 v101.47,96.52
  Bottom 0.406: E34.6 v87.5,113.03 | v238.63,96.52 236.09,96.52 234.82,97.79 200.53,97.79 197.99,100.33 186.56,100.33 185.29,101.6 175.13,101.6 170.05,97.79 157.35,97.79 154.81,100.33 131.95,100.33 128.14,96.52 v101.47,96.52
CC_F/R  (via drill 0.81)
  Top 0.406: E18.1 175.13,154.94 175.13,139.7 v173.86,138.43 | E34.5 98.93,116.84 v98.93,138.43
  Bottom 0.406: v173.86,138.43 172.59,137.16 135.76,137.16 134.49,139.7 123.06,139.7 119.25,135.89 112.9,135.89 111.63,137.16 100.2,137.16 v98.93,138.43
CC_INIT  (via drill 0.81)
  Top 0.406: E32.11 102.74,46.99 v102.74,62.23 | E37.8 83.69,69.85 86.23,67.31 v90.04,67.31
  Bottom 0.406: E32.11 E28.3 | E44.4 17.65,48.26 17.65,62.23 25.27,69.85 27.81,69.85 30.35,67.31 32.89,67.31 36.7,63.5 43.05,63.5 44.32,64.77 48.13,64.77 50.67,68.58 81.15,68.58 84.96,66.04 88.77,66.04 v90.04,67.31 91.31,66.04 98.93,66.04 v102.74,62.23
CC_PWR_OK  (via drill 0.81)
  Top 0.406: E40.11 59.56,46.99 59.56,60.96 v60.83,62.23 | E46.9 22.73,109.22 22.73,92.71 26.54,88.9 26.54,83.82 31.62,78.74 31.62,76.2 32.89,74.93 37.97,74.93 41.78,77.47 46.86,77.47 51.94,72.39 51.94,66.04 v55.75,62.23
  Bottom 0.406: E28.2 110.36,49.53 105.28,54.61 101.47,54.61 100.2,55.88 91.95,55.88 89.41,59.69 65.91,59.69 63.37,62.23 v60.83,62.23 v55.75,62.23 | E46.12 17.65,116.84 17.65,111.76 | E46.9 17.65,111.76 | 17.65,111.76 16.38,111.76
CC_R/!W  (via drill 0.81)
  Top 0.406: E35.1 100.2,157.48 100.2,106.68 v101.47,105.41 | E30.8 126.87,107.95 126.87,88.9 129.41,86.36 129.41,78.74 134.49,73.66 v134.49,62.23
  Bottom 0.406: E05.2 217.04,49.53 211.96,54.61 208.15,54.61 206.88,55.88 206.88,59.69 196.72,59.69 195.45,58.42 192.91,58.42 191.64,59.69 191.64,60.96 189.1,63.5 137.03,63.5 v134.49,62.23 | E30.8 124.33,109.22 120.52,105.41 v101.47,105.41
CC_R/W  (via drill 0.81)
  Top 0.406: E38.9 84.96,110.49 v84.96,104.14 | E35.10 109.09,147.32 v109.09,107.95
  Bottom 0.406: E30.9 124.33,111.76 119.25,106.68 110.36,106.68 v109.09,107.95 107.82,106.68 100.2,106.68 97.66,104.14 v84.96,104.14
CC_RUN  (via drill 0.81)
  Top 0.406: E46.3 E46.2 10.03,124.46 10.03,129.54 v11.3,130.81 | E37.9 86.23,77.47 86.23,80.01 88.77,82.55 88.77,88.9 87.5,90.17 87.5,92.71 91.31,96.52 v91.31,101.6 | E26.12 145.92,120.65 v145.92,129.54
  Bottom 0.406: E26.12 143.38,116.84 143.38,107.95 142.11,106.68 128.14,106.68 124.33,102.87 107.82,102.87 105.28,101.6 v91.31,101.6 | v11.3,130.81 12.57,129.54 21.46,129.54 24,127 27.81,127 30.35,129.54 46.86,129.54 48.13,128.27 69.72,128.27 73.53,132.08 79.88,132.08 82.42,128.27 110.36,128.27 112.9,130.81 140.84,130.81 v145.92,129.54
CC_S/!G  (via drill 0.81)
  Top 0.406: E05.5 229.74,46.99 v229.74,60.96 | E30.6 120.52,109.22 120.52,96.52 116.71,91.44 116.71,72.39 114.17,69.85 v114.17,63.5
  Bottom 0.406: E02.6 246.25,74.93 248.79,72.39 248.79,67.31 242.44,60.96 v229.74,60.96 228.47,62.23 224.66,62.23 220.85,59.69 210.69,59.69 206.88,62.23 196.72,62.23 195.45,63.5 191.64,63.5 190.37,64.77 135.76,64.77 129.41,62.23 126.87,62.23 v114.17,63.5
CC_S/G  (via drill 0.81)
  Top 0.406: E42.12 68.45,125.73 v68.45,132.08 68.45,144.78 v69.72,146.05 | v107.82,134.62 v107.82,110.49
  Bottom 0.406: v107.82,110.49 E30.5 | v69.72,146.05 E43.8 | v68.45,132.08 69.72,132.08 73.53,135.89 86.23,135.89 87.5,134.62 v107.82,134.62
CC_SETDLY
  Top 0.406: E04.2 242.44,156.21 242.44,142.24 243.71,140.97 243.71,113.03 E03.6 247.52,109.22 247.52,80.01 E02.5
CC_T/!M_EN  (via drill 0.81)
  Top 0.406: E43.2 51.94,161.29 v51.94,175.26 | v130.68,161.29 131.95,160.02 131.95,132.08 129.41,129.54 129.41,95.25 v130.68,93.98 | E03.10 253.87,113.03 v253.87,93.98 | E31.6 115.44,151.13 115.44,166.37 v116.71,167.64
  Bottom 0.406: v51.94,175.26 54.48,177.8 73.53,177.8 81.15,172.72 92.58,168.91 107.82,168.91 109.09,170.18 114.17,170.18 v116.71,167.64 119.25,165.1 128.14,165.1 v130.68,161.29 | v253.87,93.98 234.82,93.98 233.55,95.25 194.18,95.25 192.91,96.52 177.67,96.52 176.4,95.25 163.7,95.25 159.89,93.98 153.54,93.98 149.73,97.79 134.49,97.79 v130.68,93.98
CC_T/M_EN  (via drill 0.81)
  Top 0.406: E46.5 7.49,119.38 7.49,160.02 24,198.12 29.08,198.12 29.08,179.07 35.43,172.72 35.43,165.1 v39.24,158.75 | E31.5 120.52,148.59 120.52,144.78 v115.44,139.7 | 250.06,148.59 250.06,143.51 v253.87,139.7 255.14,137.16 255.14,82.55 | 250.06,148.59 E04.11 | 250.06,148.59 250.06,173.99 247.52,176.53 247.52,193.04 244.98,195.58 WTM.1 | E02.9 255.14,77.47 255.14,82.55 | 255.14,82.55 E02.12 | v163.7,139.7 163.7,148.59 162.43,149.86 162.43,152.4 E23.4
  Bottom 0.406: R16.1 242.44,190.5 244.98,194.31 244.98,195.58 WTM.1 | v39.24,158.75 49.4,158.75 51.94,156.21 51.94,148.59 | 51.94,148.59 51.94,144.78 55.75,140.97 88.77,140.97 90.04,142.24 112.9,142.24 v115.44,139.7 121.79,142.24 135.76,142.24 137.03,139.7 v163.7,139.7 168.78,139.7 171.32,142.24 176.4,142.24 178.94,140.97 186.56,140.97 190.37,138.43 205.61,138.43 208.15,140.97 234.82,140.97 237.36,138.43 241.17,138.43 242.44,139.7 v253.87,139.7 | 51.94,148.59 E43.6 | E23.4 162.43,153.67 163.7,154.94 163.7,157.48 162.43,158.75 E23.2
CC_TPG1
  Bottom 0.406: E14.5 201.8,189.23 199.26,191.77 199.26,199.39 200.53,200.66 205.61,200.66 208.15,195.58 E14.12
CC_TPG_CLK  (via drill 0.81)
  Top 0.406: E01.13 262.76,59.69 262.76,140.97 v260.22,143.51 | v219.58,173.99 211.96,181.61 211.96,190.5 E14.11 E14.3 | E04.9 255.14,146.05 v255.14,167.64
  Bottom 0.406: v260.22,143.51 E04.9 | v219.58,173.99 220.85,172.72 231.01,172.72 232.28,171.45 241.17,171.45 243.71,168.91 | 243.71,168.91 243.71,152.4 E04.5 | 243.71,168.91 253.87,168.91 v255.14,167.64
CC_TT_EN  (via drill 0.81)
  Top 0.406: v196.72,189.23 199.26,186.69 199.26,176.53 v201.8,173.99
  Bottom 0.406: E19.8 190.37,185.42 191.64,187.96 192.91,189.23 v196.72,189.23 | v201.8,173.99 203.07,175.26 215.77,175.26 217.04,173.99 217.04,172.72 218.31,171.45 229.74,171.45 236.09,167.64 236.09,151.13 E08.10
CC_UNIT  (via drill 0.81)
  Top 0.406: E34.9 106.55,114.3 106.55,137.16 107.82,138.43 v107.82,144.78 | v88.77,143.51 86.23,146.05 86.23,151.13 E39.11
  Bottom 0.406: E42.8 72.26,109.22 74.8,106.68 79.88,106.68 82.42,105.41 83.69,105.41 84.96,106.68 98.93,106.68 102.74,111.76 E34.9 | v107.82,144.78 106.55,143.51 v88.77,143.51
CC_UTS  (via drill 0.81)
  Top 0.406: E09.1 217.04,200.66 224.66,200.66 227.2,198.12 227.2,190.5 236.09,181.61 236.09,139.7 241.17,134.62 241.17,107.95 v244.98,104.14 | E21.13 170.05,81.28 v170.05,101.6 | v109.09,81.28 109.09,86.36 v106.55,88.9 | v90.04,107.95 90.04,105.41 92.58,102.87 92.58,96.52 90.04,93.98 v90.04,91.44
  Bottom 0.406: E38.5 79.88,111.76 79.88,107.95 82.42,106.68 83.69,106.68 84.96,107.95 v90.04,107.95 | E03.9 v244.98,104.14 243.71,101.6 201.8,101.6 200.53,102.87 186.56,102.87 185.29,104.14 173.86,104.14 v170.05,101.6 | E21.13 171.32,82.55 171.32,87.63 168.78,90.17 167.51,90.17 164.97,87.63 163.7,87.63 161.16,90.17 137.03,90.17 133.86,86.36 131.95,86.36 E29.13 124.33,81.28 119.25,90.17 116.71,90.17 109.09,82.55 v109.09,81.28 | v106.55,88.9 105.28,90.17 101.47,90.17 98.93,91.44 v90.04,91.44
CC_WRT_OK
  ECO 0.406: E46.6 8.76,111.76 8.76,129.54 73.53,129.54 76.07,132.08 78.61,132.08 81.15,129.54 130.68,129.54 130.68,121.92 E26.2
  Bottom 0.406: E46.6 15.11,111.76
CON_ALL_HALT  (via drill 0.81)
  Top 0.406: v12.57,137.16 13.84,135.89 13.84,125.73 E46.1
  Bottom 0.406: J1.RR 30.35,151.13 30.35,147.32 27.81,144.78 18.92,144.78 v12.57,137.16
DATA00  (via drill 0.81)
  Top 0.406: v238.63,102.87 241.17,100.33 241.17,95.25 239.9,93.98 239.9,48.26 E05.12 229.74,39.37 229.74,20.32 220.85,15.24 219.58,13.97 219.58,8.89 EDGE$.AR1
  Bottom 0.406: E17.10 192.91,114.3 203.07,104.14 220.85,104.14 222.12,105.41 227.2,105.41 229.74,102.87 v238.63,102.87
DATA01  (via drill 0.81)
  Top 0.406: v237.36,106.68 237.36,101.6 239.9,99.06 239.9,95.25 238.63,93.98 238.63,49.53 E05.13 227.2,39.37 227.2,20.32 218.31,15.24 217.04,15.24 217.04,8.89 EDGE$.AS1
  Bottom 0.406: E12.9 219.58,110.49 222.12,106.68 v237.36,106.68
DATA02  (via drill 0.81)
  Top 0.406: v238.63,109.22 238.63,105.41 242.44,101.6 242.44,95.25 241.17,93.98 241.17,66.04 242.44,64.77 242.44,29.21 v236.09,22.86 | EDGE$.AU1 210.69,8.89 210.69,15.24 v222.12,22.86 222.12,41.91 E05.4
  Bottom 0.406: v238.63,109.22 E07.10 | v236.09,22.86 v222.12,22.86
DATA03  (via drill 0.81)
  Top 0.406: EDGE$.AV1 206.88,8.89 206.88,13.97 219.58,22.86 219.58,24.13 220.85,25.4 220.85,43.18 E05.3 223.39,48.26 223.39,64.77 219.58,68.58 219.58,97.79 217.04,100.33 v217.04,106.68
  Bottom 0.406: E17.12 190.37,119.38 203.07,106.68 v217.04,106.68
DATA04  (via drill 0.81)
  Top 0.406: v217.04,119.38 215.77,118.11 215.77,99.06 218.31,96.52 218.31,68.58 219.58,67.31 219.58,57.15 215.77,53.34 v215.77,41.91 217.04,40.64 217.04,26.67 211.96,24.13 211.96,20.32 v209.42,17.78 | EDGE$.BR1 149.73,8.89 149.73,13.97 v153.54,19.05
  Bottom 0.406: v217.04,119.38 E12.12 | v215.77,41.91 E10.12 | v209.42,17.78 206.88,20.32 199.26,20.32 197.99,19.05 189.1,19.05 187.83,17.78 166.24,17.78 163.7,20.32 159.89,20.32 158.62,19.05 v153.54,19.05
DATA05  (via drill 0.81)
  Top 0.406: EDGE$.BS1 147.19,8.89 147.19,13.97 v151,19.05 | v238.63,119.38 239.9,118.11 239.9,105.41 243.71,101.6 243.71,95.25 242.44,93.98 242.44,67.31 v243.71,66.04 | v214.5,22.86 218.31,25.4 v218.31,44.45 220.85,46.99 v220.85,64.77
  Bottom 0.406: v238.63,119.38 E07.12 | E10.13 v218.31,44.45 | v151,19.05 152.27,20.32 158.62,20.32 159.89,21.59 168.78,21.59 170.05,20.32 186.56,20.32 187.83,21.59 195.45,21.59 196.72,22.86 v214.5,22.86 | v220.85,64.77 242.44,64.77 v243.71,66.04
DATA06  (via drill 0.81)
  Top 0.406: v175.13,114.3 172.59,111.76 172.59,58.42 176.4,54.61 176.4,39.37 175.13,38.1 175.13,35.56 176.4,34.29 176.4,29.21 v171.32,24.13 | EDGE$.BU1 140.84,8.89 140.84,15.24 v148.46,22.86 | v201.8,27.94 201.8,43.18 E10.4
  Bottom 0.406: v175.13,114.3 E17.5 | v148.46,22.86 158.62,22.86 159.89,24.13 v171.32,24.13 177.67,24.13 178.94,22.86 184.02,22.86 185.29,24.13 194.18,24.13 195.45,25.4 199.26,25.4 v201.8,27.94
DATA07  (via drill 0.81)
  Top 0.406: EDGE$.BV1 137.03,8.89 137.03,13.97 138.3,15.24 139.57,15.24 145.92,21.59 v145.92,24.13 | v199.26,27.94 200.53,29.21 200.53,44.45 E10.3 208.15,52.07 208.15,64.77 206.88,66.04 206.88,87.63 204.34,90.17 204.34,113.03 E12.5
  Bottom 0.406: v145.92,24.13 158.62,24.13 161.16,26.67 173.86,26.67 175.13,25.4 178.94,25.4 180.21,24.13 184.02,24.13 185.29,25.4 194.18,25.4 196.72,27.94 v199.26,27.94
DATA08  (via drill 0.81)
  Top 0.406: EDGE$.DR1 16.38,8.89 v16.38,22.86 | v181.48,27.94 182.75,26.67 187.83,26.67 191.64,30.48 191.64,39.37 E15.12 191.64,44.45 191.64,54.61 196.72,59.69 196.72,62.23 194.18,64.77 194.18,107.95 196.72,110.49 v196.72,124.46
  Bottom 0.406: E07.4 223.39,116.84 217.04,127 199.26,127 v196.72,124.46 | v16.38,22.86 17.65,24.13 100.2,24.13 102.74,27.94 107.82,27.94 109.09,25.4 158.62,25.4 166.24,33.02 175.13,33.02 181.48,29.21 v181.48,27.94
DATA09  (via drill 0.81)
  Top 0.406: EDGE$.DS1 13.84,8.89 v13.84,25.4 | v191.64,107.95 192.91,106.68 192.91,64.77 195.45,62.23 195.45,59.69 190.37,54.61 190.37,45.72 E15.13 186.56,41.91 186.56,33.02 v184.02,30.48
  Bottom 0.406: v13.84,25.4 98.93,25.4 101.47,29.21 109.09,29.21 110.36,26.67 158.62,26.67 166.24,34.29 175.13,34.29 181.48,30.48 v184.02,30.48 | E17.7 185.29,109.22 187.83,106.68 190.37,106.68 v191.64,107.95
DATA10  (via drill 0.81)
  Top 0.406: EDGE$.DU1 7.49,8.89 7.49,22.86 12.57,27.94 v13.84,27.94 | v194.18,110.49 v194.18,119.38 | v177.67,36.83 178.94,38.1 178.94,41.91 E15.4 178.94,46.99 178.94,54.61 175.13,58.42 175.13,99.06 173.86,100.33 173.86,107.95 v175.13,109.22
  Bottom 0.406: v194.18,119.38 E12.7 | v13.84,27.94 15.11,26.67 97.66,26.67 100.2,30.48 110.36,30.48 111.63,27.94 158.62,27.94 166.24,35.56 170.05,35.56 171.32,36.83 v177.67,36.83 | v194.18,110.49 194.18,106.68 192.91,105.41 187.83,105.41 186.56,106.68 177.67,106.68 v175.13,109.22
DATA11  (via drill 0.81)
  Top 0.406: EDGE$.DV1 3.68,8.89 3.68,62.23 8.76,67.31 8.76,69.85 4.95,73.66 v4.95,96.52 | v224.66,102.87 E07.7 | E15.3 180.21,48.26 180.21,54.61 176.4,58.42 176.4,105.41 v175.13,106.68
  Bottom 0.406: v4.95,96.52 48.13,96.52 51.94,100.33 65.91,100.33 68.45,97.79 93.85,97.79 95.12,99.06 105.28,99.06 107.82,100.33 125.6,100.33 129.41,104.14 156.08,104.14 158.62,101.6 162.43,101.6 164.97,104.14 v175.13,106.68 176.4,105.41 185.29,105.41 186.56,104.14 200.53,104.14 201.8,102.87 v224.66,102.87
DF_COMP_WD  (via drill 0.81)
  Top 0.406: E18.5 180.21,149.86 180.21,128.27 v177.67,124.46
  Bottom 0.406: E22.3 159.89,119.38 158.62,120.65 158.62,124.46 159.89,125.73 162.43,125.73 166.24,121.92 E22.13 170.05,120.65 175.13,120.65 v177.67,124.46 | E18.5 E18.9 190.37,148.59 191.64,149.86 191.64,154.94 190.37,156.21 E18.12
DF_DB00  (via drill 0.81)
  Top 0.406: v184.02,138.43 185.29,137.16 185.29,128.27 E17.14 186.56,121.92 186.56,85.09 E16.14 | E34.12 105.28,120.65 105.28,138.43 v104.01,139.7 | E42.9 70.99,120.65 v70.99,138.43
  Bottom 0.406: v184.02,138.43 178.94,138.43 175.13,140.97 172.59,140.97 170.05,138.43 137.03,138.43 134.49,140.97 121.79,140.97 117.98,137.16 114.17,137.16 111.63,139.7 v104.01,139.7 102.74,140.97 97.66,140.97 95.12,138.43 v70.99,138.43
DF_DB01  (via drill 0.81)
  Top 0.406: E34.2 95.12,123.19 95.12,130.81 v96.39,132.08 | E18.2 176.4,153.67 v176.4,133.35 | 213.23,124.46 E12.14 | v213.23,133.35 213.23,124.46 | E11.14 213.23,85.09 213.23,124.46
  Bottom 0.406: v96.39,132.08 109.09,132.08 110.36,133.35 125.6,133.35 126.87,135.89 130.68,135.89 131.95,133.35 v176.4,133.35 177.67,134.62 204.34,134.62 205.61,133.35 v213.23,133.35
DF_DB02  (via drill 0.81)
  Top 0.406: E42.13 67.18,127 67.18,156.21 65.91,157.48 65.91,172.72 74.8,181.61 v74.8,182.88 | 234.82,124.46 E07.14 | v232.28,176.53 233.55,175.26 233.55,130.81 234.82,129.54 234.82,124.46 | 234.82,124.46 234.82,85.09 E06.14 | E30.2 120.52,124.46 120.52,135.89 121.79,137.16 121.79,173.99 v125.6,177.8
  Bottom 0.406: v74.8,182.88 77.34,180.34 106.55,180.34 107.82,179.07 124.33,179.07 v125.6,177.8 126.87,176.53 143.38,176.53 147.19,173.99 178.94,173.99 180.21,175.26 196.72,175.26 199.26,177.8 218.31,177.8 220.85,180.34 224.66,180.34 227.2,175.26 231.01,175.26 v232.28,176.53
DF_DB03  (via drill 0.81)
  Top 0.406: v191.64,129.54 190.37,128.27 190.37,123.19 E17.13 187.83,120.65 187.83,86.36 E16.15
  Bottom 0.406: E30.12 126.87,118.11 133.22,118.11 138.3,125.73 149.73,125.73 152.27,127 156.08,127 161.16,129.54 175.13,129.54 176.4,128.27 184.02,128.27 185.29,129.54 185.29,130.81 186.56,132.08 190.37,132.08 191.64,130.81 v191.64,129.54
DF_SEL_ER  (via drill 0.81)
  Top 0.406: E32.12 109.09,50.8 v109.09,60.96
  Bottom 0.406: E37.6 78.61,74.93 82.42,71.12 90.04,71.12 93.85,67.31 101.47,67.31 v109.09,60.96
DF_TIME_ER  (via drill 0.81)
  Top 0.406: v90.04,152.4 90.04,158.75 92.58,161.29 v92.58,171.45 | v57.02,142.24 58.29,140.97 58.29,87.63 55.75,85.09 E41.2
  Bottom 0.406: E35.6 v90.04,152.4 86.23,149.86 86.23,144.78 83.69,142.24 v57.02,142.24 | E37.5 78.61,78.74 78.61,88.9 77.34,90.17 54.48,90.17 53.21,88.9 53.21,86.36 E41.2 | E27.13 145.92,158.75 144.65,160.02 144.65,161.29 145.92,162.56 145.92,163.83 144.65,165.1 131.95,165.1 130.68,166.37 121.79,166.37 116.71,171.45 107.82,171.45 106.55,170.18 95.12,170.18 v92.58,171.45
F/!R  (via drill 0.81)
  Top 0.406: v83.69,133.35 E39.8
  Bottom 0.406: J1.TT 29.08,149.86 29.08,147.32 27.81,146.05 13.84,146.05 10.03,142.24 10.03,135.89 15.11,130.81 22.73,130.81 25.27,128.27 27.81,128.27 29.08,132.08 34.16,137.16 43.05,137.16 53.21,129.54 69.72,129.54 73.53,133.35 v83.69,133.35
GND  (via drill 0.81)
  Top 0.813: EDGE$.DT1 10.03,8.89 v10.03,19.05 | EDGE$.DN1 22.73,8.89 22.73,16.51 v21.46,17.78 | EDGE$.DC2 51.94,8.89 v51.94,17.78 | v51.94,17.78 43.05,17.78 41.78,16.51 41.78,7.62 EDGE$.DF1 | v51.94,17.78 51.94,34.29 E40.7 55.75,36.83 60.83,31.75 60.83,29.21 79.88,20.32 79.88,8.89 EDGE$.CT1 | J1.B J1.A J1.C J1.E J1.H J1.K J1.M J1.P J1.S J1.U J1.W J1.Y J1.AA J1.CC J1.EE J1.HH J1.KK J1.MM J1.PP J1.SS J1.UU J1.VV | EDGE$.AT1 213.23,8.89 213.23,15.24 218.31,17.78 v219.58,17.78 224.66,20.32 E05.8 | EDGE$.AN1 225.93,8.89 225.93,15.24 232.28,17.78 239.9,17.78 | C34.- 239.9,17.78 | EDGE$.AF1 244.98,8.89 244.98,17.78 | 239.9,17.78 244.98,17.78 | 244.98,17.78 244.98,27.94 | 244.98,27.94 E01.7 248.79,40.64 248.79,57.15 C1.2 251.33,62.23 C2.2 246.25,72.39 E02.7 | 244.98,27.94 C45.2 | C40.2 264.03,157.48 264.03,191.77 255.14,200.66 244.98,200.66 | 244.98,200.66 WTM.2 | 11.3,109.22 E46.7 | 11.3,109.22 C32.2 10.03,104.14 7.49,101.6 7.49,74.93 E45.8 12.57,66.04 8.76,62.23 C47.2 | 11.3,109.22 4.95,109.22 3.05,111.12 3.05,135.25 C48.1 | E38.7 74.8,107.95 C24.2 | EDGE$.CN1 92.58,8.89 92.58,13.97 v96.39,17.78 92.58,21.59 92.58,30.48 E32.7 | C46.- 57.02,102.87 | 57.02,102.87 C27.2 52.58,90.17 52.58,82.55 | 57.02,102.87 57.02,109.22 | 57.02,109.22 E42.7 | 57.02,109.22 C28.2 54.48,134.62 E43.7 | E41.7 52.58,74.3 52.58,82.55 | 52.58,82.55 C26.2 | E20.1 C16.2 E21.8 158.62,72.39 158.62,101.6 157.99,102.87 158.62,104.14 158.62,106.68 E22.7 163.7,111.76 163.7,137.16 161.16,139.7 E23.7 | C17.2 175.13,118.11 177.67,115.57 177.67,105.41 178.94,104.14 178.94,96.52 177.67,95.25 177.67,72.39 E16.8 C13.2 181.48,57.15 184.02,54.61 184.02,36.83 E15.8 v177.67,27.94 177.67,17.78
  Top 0.813: v162.43,17.78 175.13,17.78 | EDGE$.BF2 175.13,8.89 175.13,17.78 | EDGE$.BC2 185.29,8.89 185.29,17.78 | 175.13,17.78 177.67,17.78 | 177.67,17.78 185.29,17.78 | v167.51,30.48 166.24,31.75 166.24,41.91 | 166.24,41.91 E20.10 | E20.12 166.24,44.45 166.24,41.91 | 185.29,17.78 192.91,17.78 197.99,25.4 | 197.99,25.4 v205.61,25.4 205.61,27.94 203.07,30.48 E10.8 | 197.99,25.4 196.72,26.67 196.72,29.21 199.26,31.75 199.26,45.72 200.53,46.99 200.53,53.34 C10.2 204.34,59.69 204.34,68.58 E11.8 | E12.1 205.61,121.92 C11.2 | 225.93,129.54 227.2,129.54 227.2,124.46 | 225.93,129.54 C7.2 | 227.2,124.46 E07.1 | 227.2,124.46 C6.2 227.2,69.85 | 225.93,129.54 225.93,143.51 | 225.93,143.51 225.93,161.29 | 225.93,161.29 C8.2 C9.2 E09.7 | 225.93,143.51 E08.8 | C25.2 87.5,160.02 87.5,148.59 v90.04,146.05 | EDGE$.BT1 143.38,8.89 143.38,13.97 v147.19,19.05 | 124.33,16.51 v123.06,17.78 121.79,16.51 | 124.33,16.51 128.14,16.51 130.68,19.05 130.68,21.59 | 130.68,21.59 C21.2 131.95,30.48 131.95,39.37 137.67,45.09 137.67,52.07 | 130.68,21.59 v139.57,21.59 | EDGE$.CC2 121.79,8.89 121.79,16.51 | 124.33,16.51 121.79,16.51 | EDGE$.CF1 111.63,8.89 111.63,15.24 C35.- | v117.98,20.32 E28.7 115.44,39.37 115.44,44.45 | 115.44,44.45 115.44,49.53 E28.1 117.98,57.15 | 117.98,57.15 C22.2 | 117.98,57.15 E29.8 | 137.67,52.07 E24.1 | 137.67,52.07 137.67,55.24 C18.2 140.84,71.12 E25.7 137.03,74.93 137.03,95.25 139.57,97.79 E26.7 142.11,111.76 142.11,140.97 139.57,143.51 E27.7 | 115.44,44.45 E28.4 | v87.5,69.85 87.5,78.74 v88.77,80.01 | C5.2 227.2,69.85 | 227.2,69.85 E06.8 | 147.19,176.53 C20.2 | 147.19,176.53 144.65,179.07 v144.65,191.77 | R37.2 v39.24,166.37 37.97,167.64 37.97,195.58 41.78,199.39 v46.86,199.39
  Top 0.813: C4.2 246.25,186.69 239.9,193.04 239.9,195.58 244.98,200.66 | E19.7 181.48,171.45 v172.59,162.56 | E04.8 247.52,140.97 C3.2 | 147.19,176.53 142.11,171.45 v142.11,163.83 | E35.7 96.39,134.62 93.85,132.08 93.85,111.76 E34.7 96.39,105.41 98.93,102.87 C23.2 93.85,90.17 93.85,74.93 E33.7 | C15.2 192.91,185.42 192.91,160.02 195.45,157.48 195.45,152.4 194.18,151.13 194.18,143.51 196.72,140.97 v196.72,129.54 | E17.1 181.48,129.54 | 181.48,129.54 C14.2 | 181.48,129.54 E18.7 | E14.7 206.88,180.34 206.88,154.94 E13.12 | E31.7 114.17,142.24 114.17,133.35 116.71,132.08 116.71,125.73 114.17,123.19 114.17,110.49 v112.9,109.22 112.9,77.47 v111.63,76.2 | 225.93,161.29 E08.1
  Bottom 0.813: v10.03,19.05 EDGE$.DT1 10.03,8.89 v10.03,19.05 | v10.03,19.05 3.68,25.4 3.68,59.69 C47.2 C31.2 E44.1 | v21.46,17.78 11.3,17.78 v10.03,19.05 | EDGE$.DN1 22.73,8.89 22.73,17.78 v21.46,17.78 | 41.78,17.78 v21.46,17.78 | v51.94,17.78 41.78,17.78 | EDGE$.DC2 51.94,8.89 v51.94,17.78 | EDGE$.DF1 41.78,8.89 41.78,17.78 | E40.7 50.67,33.02 36.7,33.02 34.16,35.56 C41.1 C42.1 D2.A 29.08,45.72 C43.2 | C48.1 4.95,143.51 10.03,149.86 22.73,149.86 J1.UU | EDGE$.AC2 255.14,8.89 255.14,15.24 252.6,17.78 244.98,17.78 | 239.9,17.78 244.98,17.78 | 239.9,17.78 C34.- 237.36,25.4 209.42,25.4 208.15,24.13 206.88,24.13 v205.61,25.4 | EDGE$.AF1 244.98,8.89 244.98,17.78 | EDGE$.AT1 213.23,8.89 213.23,15.24 215.77,17.78 v219.58,17.78 225.93,17.78 | 239.9,17.78 225.93,17.78 | EDGE$.AN1 225.93,8.89 225.93,17.78 | E03.7 248.79,111.76 248.79,128.27 C3.2 | E14.7 C15.2 | 248.79,161.29 248.79,146.05 E04.8 242.44,146.05 236.09,146.05 233.55,143.51 E08.9 E08.8 218.31,143.51 215.77,146.05 215.77,148.59 211.96,151.13 E13.12 | 248.79,161.29 248.79,163.83 C4.2 | 248.79,161.29 E04.1 | E18.7 180.21,146.05 173.86,151.13 v172.59,162.56 | J1.B 30.35,199.39 v46.86,199.39 50.67,196.85 68.45,196.85 72.26,200.66 87.5,200.66 90.04,198.12 110.36,198.12 114.17,194.31 C30.2 119.25,193.04 121.79,190.5 143.38,190.5 v144.65,191.77 | C12.2 v196.72,129.54 194.18,127 194.18,124.46 196.72,121.92 197.99,121.92 200.53,124.46 E12.1 | Q4.3 Q5.3 46.86,127 51.94,120.65 51.94,110.49 E42.7 57.02,106.68 72.26,106.68 C24.2 | E28.10 126.87,41.91 138.3,52.07 E24.1 | E36.10 92.58,41.91 96.39,36.83 E32.7 | v87.5,69.85 83.69,68.58 E37.7 73.53,69.85 68.45,69.85